# EAGLE schematic smartstand-usb-dac-amplifier-rev-a (EAGLE 7.3.0)

## Sheet 1 of 13
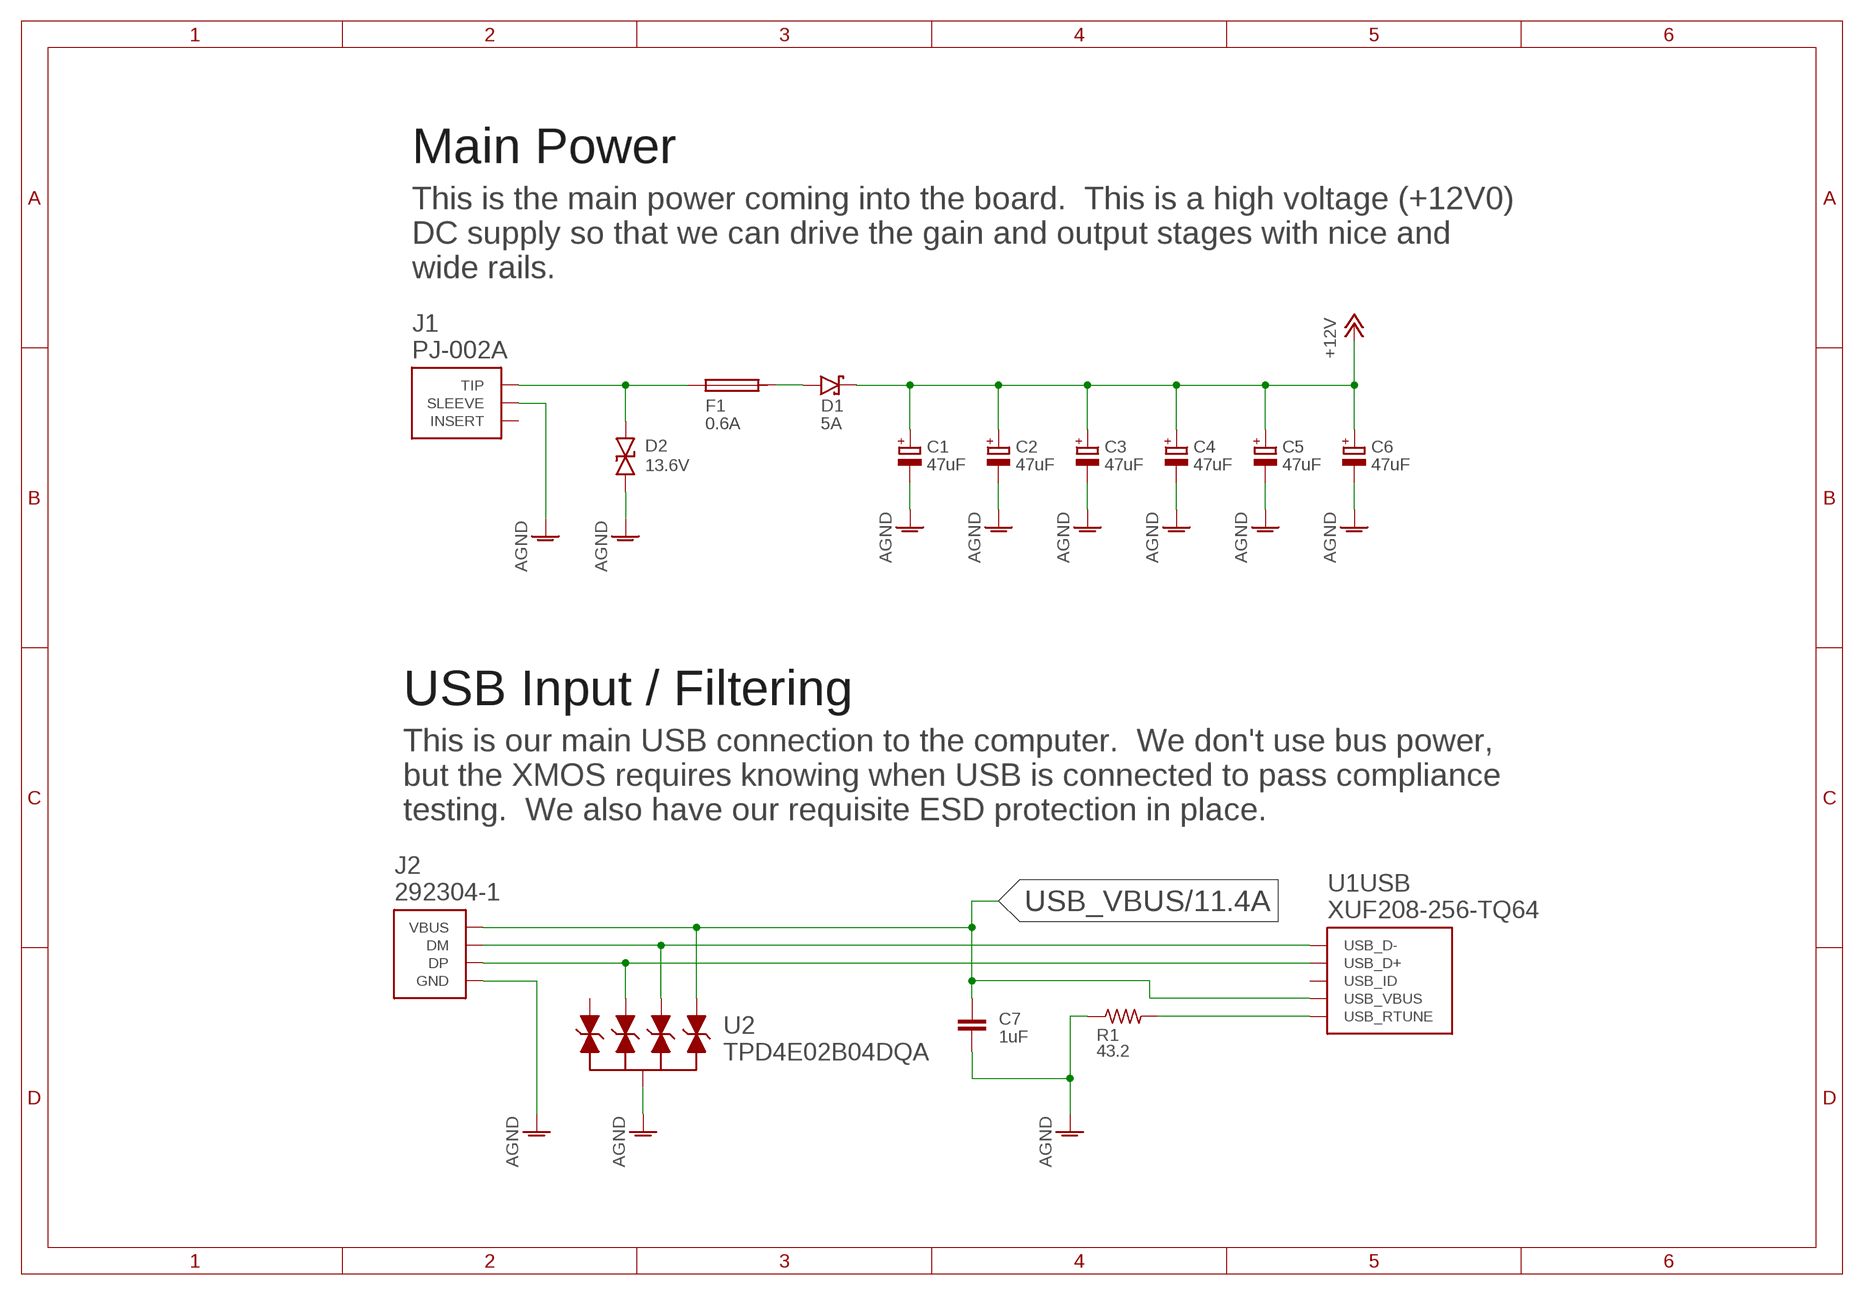
[diagram p0: schematic, sheet 1]
SHEET1 (A4L-NODOC): BOM: EXCLUDE

### Parts
C1  47uF  CAPACITOR-POLARIZEDCHEMICON_F55  [CHEMICON_F55]
C2  47uF  CAPACITOR-POLARIZEDCHEMICON_F55  [CHEMICON_F55]
C3  47uF  CAPACITOR-POLARIZEDCHEMICON_F55  [CHEMICON_F55]
C4  47uF  CAPACITOR-POLARIZEDCHEMICON_F55  [CHEMICON_F55]
C5  47uF  CAPACITOR-POLARIZEDCHEMICON_F55  [CHEMICON_F55]
C6  47uF  CAPACITOR-POLARIZEDCHEMICON_F55  [CHEMICON_F55]
C7  1uF  CAPACITOR-0603  [C0603]
D1  5A  PMEG3050BEP  [SOD128]
D2  13.6V  SUPPRESSOR-DUAL-SMA  [SMA]
F1  0.6A  LITTLEFUSE2920L  [2920L]
J1  PJ-002A  [PJ-002A]
J2  292304-1  [292304]
R1  43.2  RESISTOR-HORIZONTAL-0402  [R0402]
U1  XUF208-256-TQ64  [TQFP-64-EXPOSED-PAD]
U2  TPD4E02B04DQA  [R-PUSON-N10]

### Nets
+12V: C1.+ C2.+ C3.+ C4.+ C5.+ C6.+ D1.C ; also sheet 2,3,7,10,12,13
AGND: C1.- C2.- C3.- C4.- C5.- C6.- C7.2 D2.A J1.2(SLEEVE) J2.P$4(GND) R1.1 U2.P$3(GND) U2.P$8(GND) ; also sheet 2,3,4,5,6,7,8,9,10,11,12,13
N$7: D2.C F1.P$1 J1.1(TIP)
N$8: D1.A F1.P$2
N$37: R1.2 U1.P$24(USB:USB_RTUNE)
USB_D_N [USB]: J2.P$2(DM) U1.P$26(USB:USB_D-) U2.P$4(IO3) U2.P$7(IO3)
USB_D_P [USB]: J2.P$3(DP) U1.P$25(USB:USB_D+) U2.P$2(IO2) U2.P$9(IO2)
USB_VBUS: C7.1 J2.P$1(VBUS) U1.P$23(USB:USB_VBUS) U2.P$5(IO4) U2.P$6(IO4) ; also sheet 11
Unconnected: J1.3(INSERT) U1.P$21(USB:USB_ID) U2.P$1(IO1) U2.P$10(IO1)

### Notes on the sheet
- Main Power
- This is the main power coming into the board.  This is a high voltage (+12V0)
  DC supply so that we can drive the gain and output stages with nice and
  wide rails.
- USB Input / Filtering
- This is our main USB connection to the computer.  We don't use bus power,
  but the XMOS requires knowing when USB is connected to pass compliance
  testing.  We also have our requisite ESD protection in place.

## Sheet 2 of 13
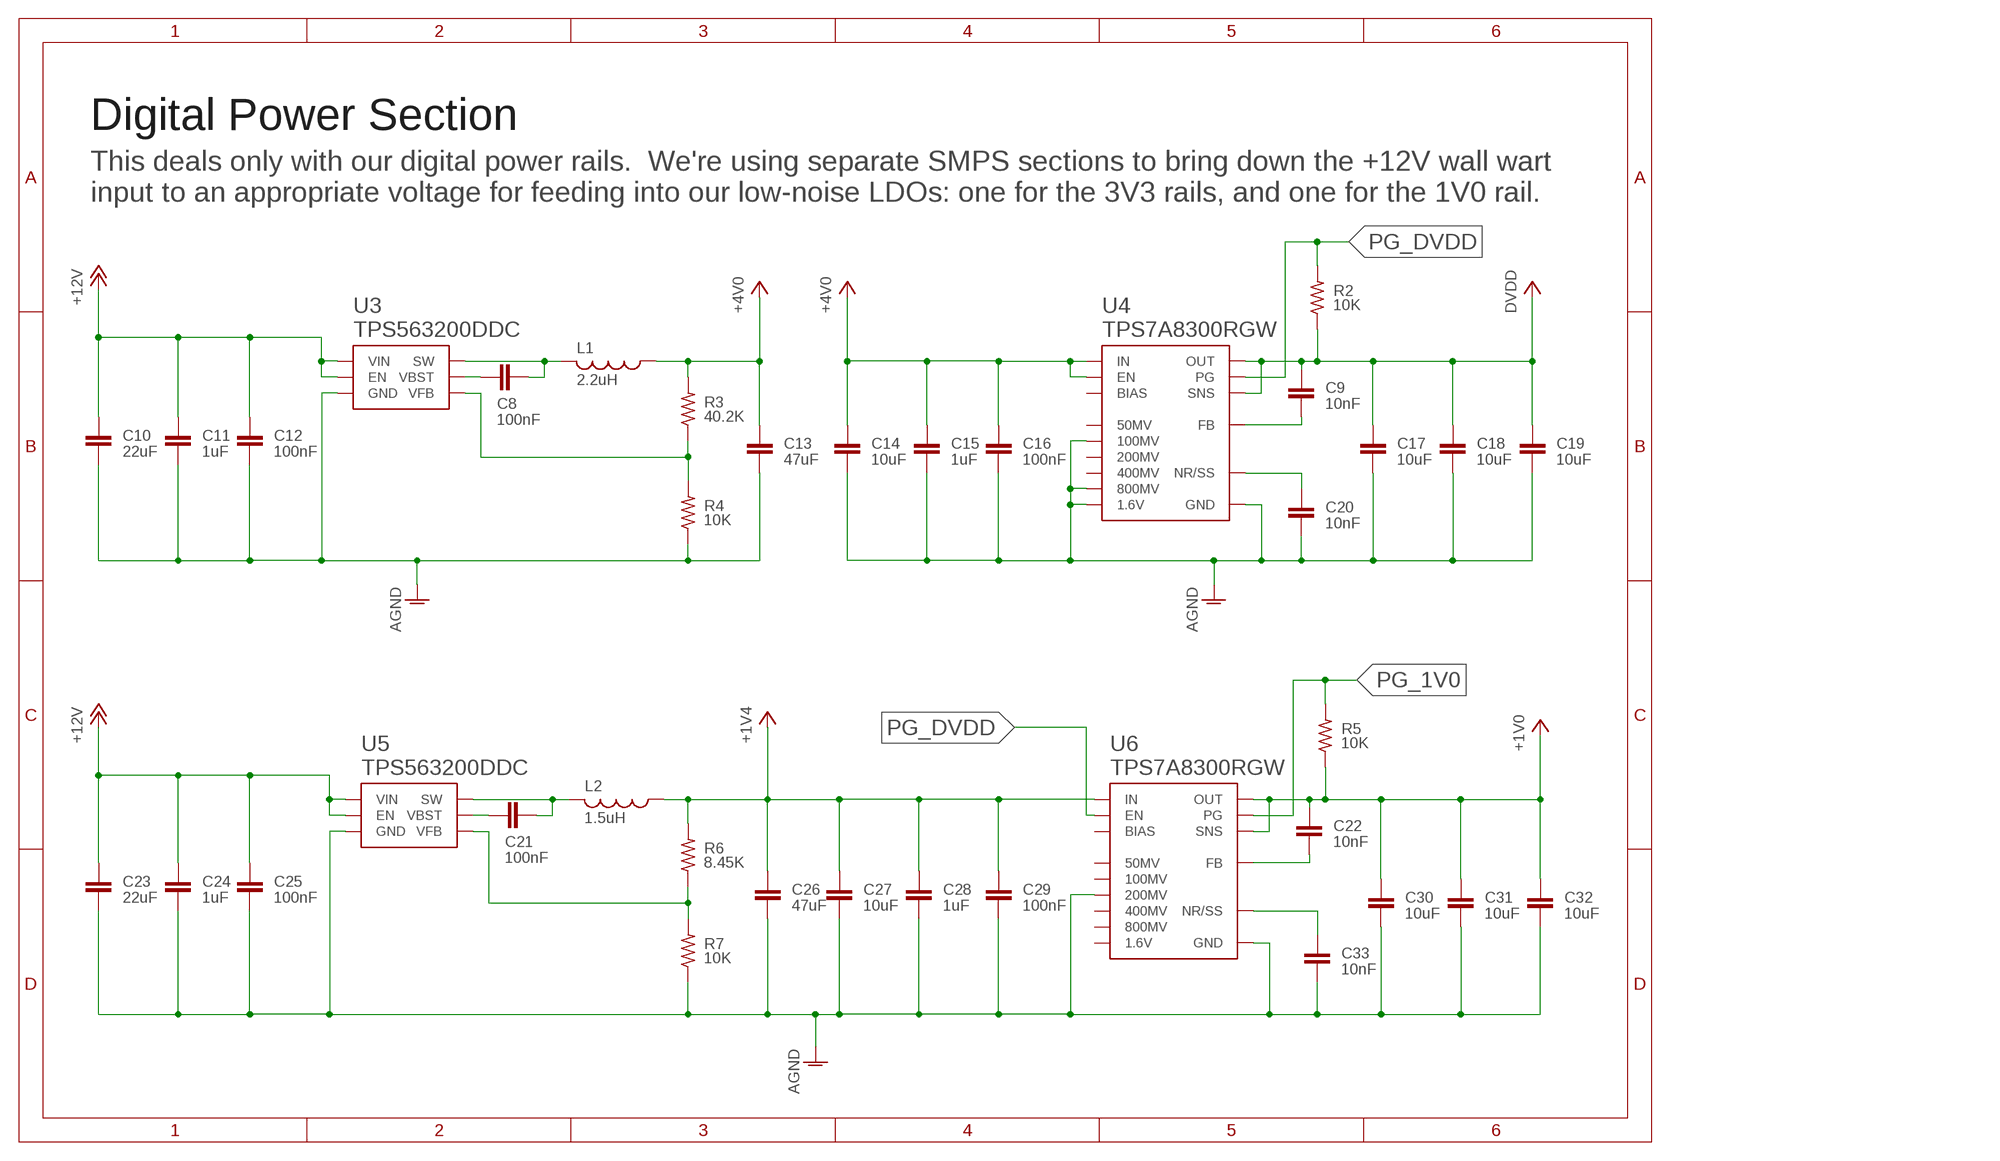
[diagram p1: schematic, sheet 2]
SHEET2 (A4L-NODOC): BOM: EXCLUDE

### Parts
C8  100nF  CAPACITOR-HORIZONTAL-0805  [C0805]
C9  10nF  CAPACITOR-0402  [C0402]
C10  22uF  CAPACITOR-1206  [C1206]
C11  1uF  CAPACITOR-0603  [C0603]
C12  100nF  CAPACITOR-0402  [C0402]
C13  47uF  CAPACITOR-1206  [C1206]
C14  10uF  CAPACITOR-0805  [C0805]
C15  1uF  CAPACITOR-0603  [C0603]
C16  100nF  CAPACITOR-0402  [C0402]
C17  10uF  CAPACITOR-0805  [C0805]
C18  10uF  CAPACITOR-0805  [C0805]
C19  10uF  CAPACITOR-0805  [C0805]
C20  10nF  CAPACITOR-0402  [C0402]
C21  100nF  CAPACITOR-HORIZONTAL-0805  [C0805]
C22  10nF  CAPACITOR-0402  [C0402]
C23  22uF  CAPACITOR-1206  [C1206]
C24  1uF  CAPACITOR-0603  [C0603]
C25  100nF  CAPACITOR-0402  [C0402]
C26  47uF  CAPACITOR-1206  [C1206]
C27  10uF  CAPACITOR-0805  [C0805]
C28  1uF  CAPACITOR-0603  [C0603]
C29  100nF  CAPACITOR-0402  [C0402]
C30  10uF  CAPACITOR-0805  [C0805]
C31  10uF  CAPACITOR-0805  [C0805]
C32  10uF  CAPACITOR-0805  [C0805]
C33  10nF  CAPACITOR-0402  [C0402]
L1  2.2uH  INDUCTOR-HORIZONTALVLP8040  [TDK-VLP8040]
L2  1.5uH  INDUCTOR-HORIZONTALVLP8040  [TDK-VLP8040]
R2  10K  RESISTOR-0402  [R0402]
R3  40.2K  RESISTOR-0402  [R0402]
R4  10K  RESISTOR-0402  [R0402]
R5  10K  RESISTOR-0402  [R0402]
R6  8.45K  RESISTOR-0402  [R0402]
R7  10K  RESISTOR-0402  [R0402]
U3  TPS563200DDC  [R-PDSO-G6-DBV]
U4  TPS7A8300RGW  [S-PVQFN-N20]
U5  TPS563200DDC  [R-PDSO-G6-DBV]
U6  TPS7A8300RGW  [S-PVQFN-N20]

### Nets
+1V0: C22.1 C30.1 C31.1 C32.1 R5.1 U6.P$1(OUT) U6.P$2(SNS) U6.P$19(OUT) U6.P$20(OUT) ; also sheet 4,5,12
+1V4: C26.1 C27.1 C28.1 C29.1 L2.P$1 R6.2 U6.P$15(IN) U6.P$16(IN) U6.P$17(IN) ; also sheet 12
+4V0: C13.1 C14.1 C15.1 C16.1 L1.P$1 R3.2 U4.P$14(EN) U4.P$15(IN) U4.P$16(IN) U4.P$17(IN) ; also sheet 3,4,12
+12V: C10.1 C11.1 C12.1 C23.1 C24.1 C25.1 U3.3(VIN) U3.5(EN) U5.3(VIN) U5.5(EN) ; also sheet 1,3,7,10,12,13
AGND: C10.2 C11.2 C12.2 C13.2 C14.2 C15.2 C16.2 C17.2 C18.2 C19.2 C20.2 C23.2 C24.2 C25.2 C26.2 C27.2 C28.2 C29.2 C30.2 C31.2 C32.2 C33.2 R4.1 R7.1 U3.1(GND) U4.P$6(100MV) U4.P$8(GND) U4.P$10(800MV) U4.P$11(1.6V) U4.P$18(GND) U4.P$21(GND) U4.P$22(GND) U4.P$23(GND) U4.P$24(GND) U4.P$25(GND) U4.P$26(GND) U4.P$27(GND) U4.P$28(GND) U4.P$29(GND) U4.P$EP(GND) U5.1(GND) U6.P$7(200MV) U6.P$8(GND) U6.P$18(GND) U6.P$21(GND) U6.P$22(GND) U6.P$23(GND) U6.P$24(GND) U6.P$25(GND) U6.P$26(GND) U6.P$27(GND) U6.P$28(GND) U6.P$29(GND) U6.P$EP(GND) ; also sheet 1,3,4,5,6,7,8,9,10,11,12,13
DVDD: C9.1 C17.1 C18.1 C19.1 R2.1 U4.P$1(OUT) U4.P$2(SNS) U4.P$19(OUT) U4.P$20(OUT) ; also sheet 4,5,6,9,10,11,12
N$9: C20.1 U4.P$13(NR/SS)
N$11: C9.2 U4.P$3(FB)
N$50: C8.2 L1.P$2 U3.2(SW)
N$52: C8.1 U3.6(VBST)
N$53: R3.1 R4.2 U3.4(VFB)
N$54: C21.2 L2.P$2 U5.2(SW)
N$55: C21.1 U5.6(VBST)
N$56: R6.1 R7.2 U5.4(VFB)
N$57: C33.1 U6.P$13(NR/SS)
N$58: C22.2 U6.P$3(FB)
PG_1V0: R5.2 U6.P$4(PG)
PG_DVDD: R2.2 U4.P$4(PG) U6.P$14(EN)
Unconnected: U4.P$5(50MV) U4.P$7(200MV) U4.P$9(400MV) U4.P$12(BIAS) U6.P$5(50MV) U6.P$6(100MV) U6.P$9(400MV) U6.P$10(800MV) U6.P$11(1.6V) U6.P$12(BIAS)

### Notes on the sheet
- Digital Power Section
- This deals only with our digital power rails.  We're using separate SMPS sections to bring down the +12V wall wart
  input to an appropriate voltage for feeding into our low-noise LDOs: one for the 3V3 rails, and one for the 1V0 rail.

## Sheet 3 of 13
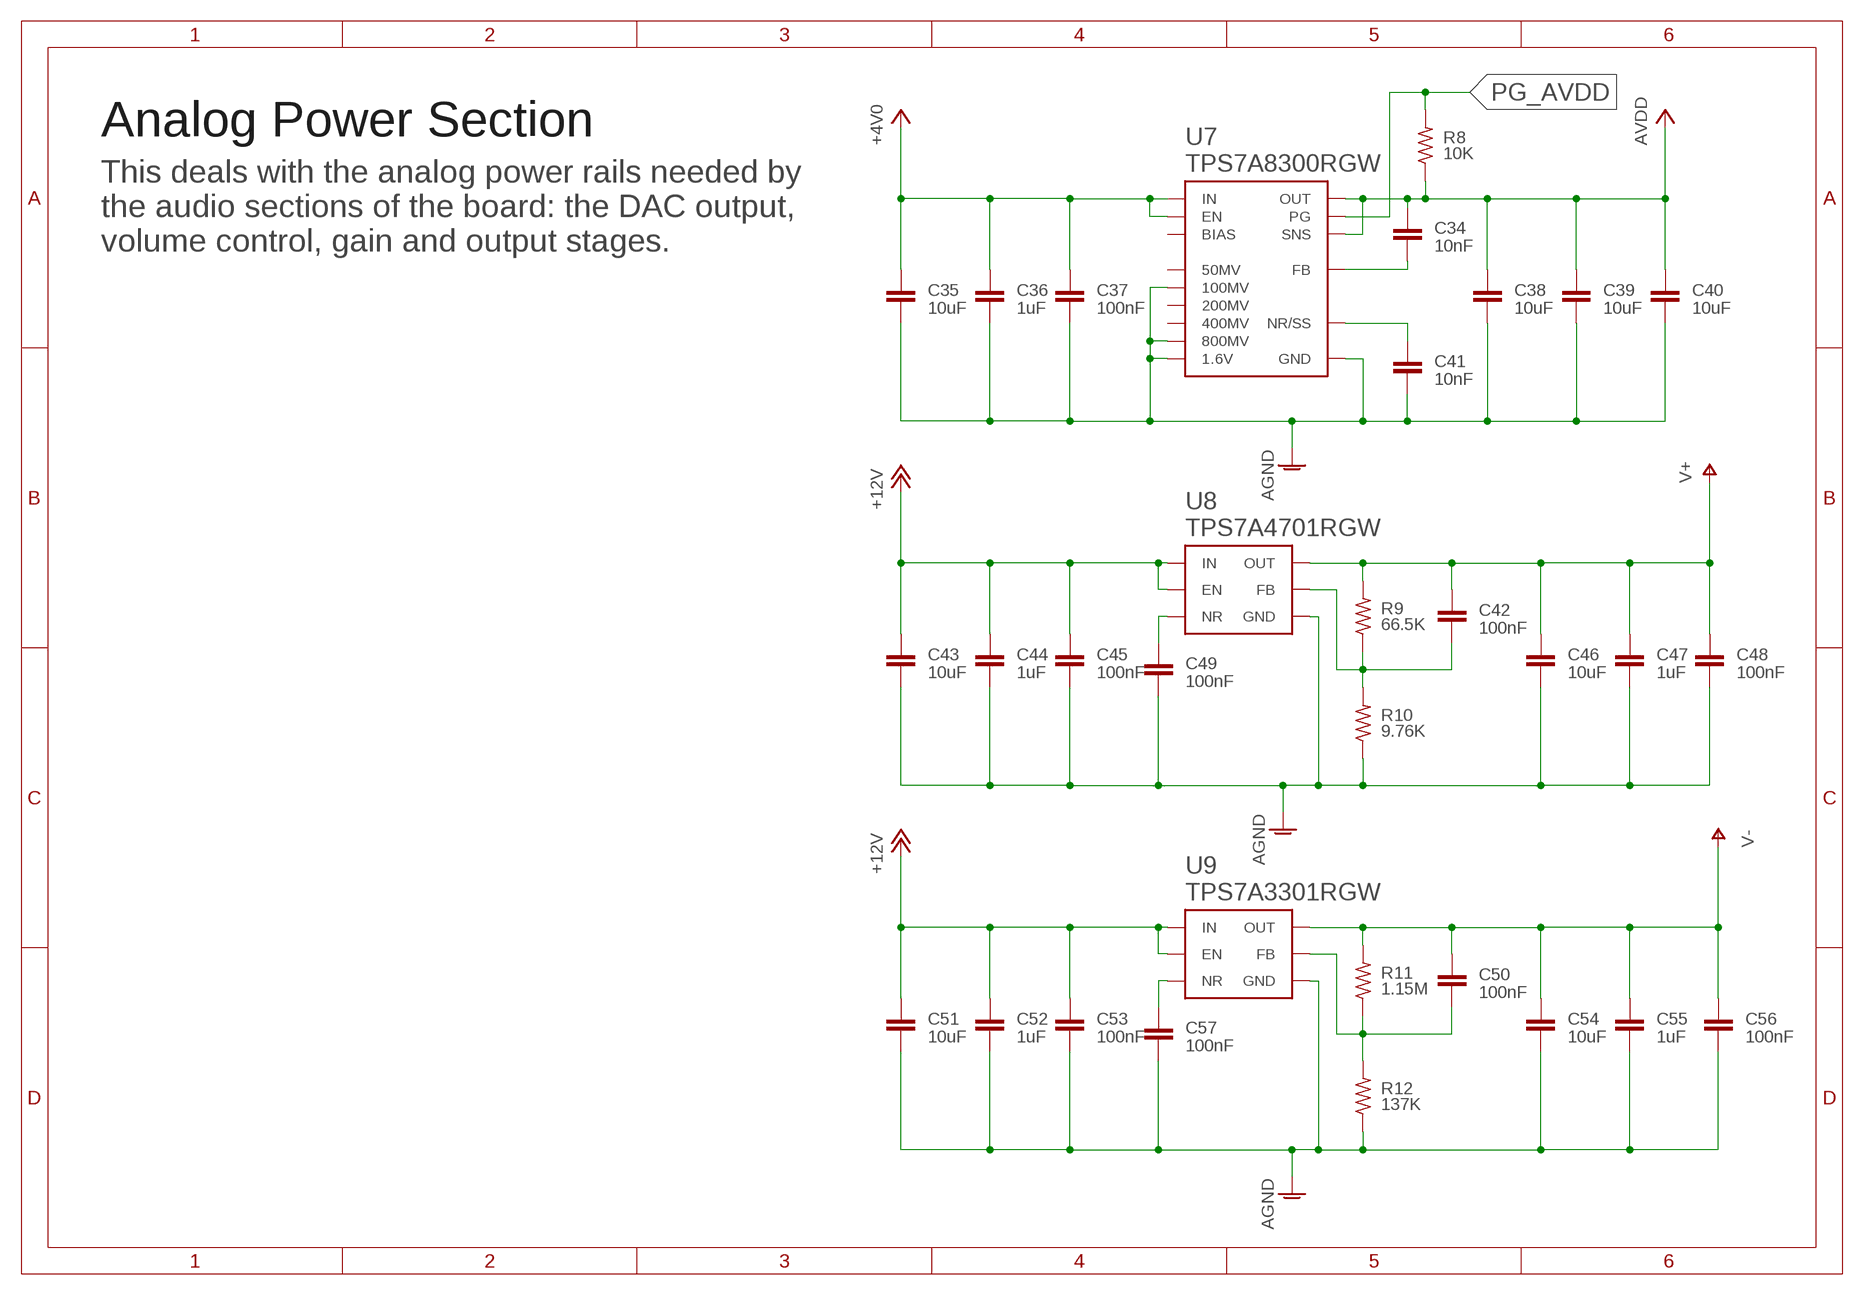
[diagram p2: schematic, sheet 3]
SHEET3 (A4L-NODOC): BOM: EXCLUDE

### Parts
C34  10nF  CAPACITOR-0402  [C0402]
C35  10uF  CAPACITOR-0805  [C0805]
C36  1uF  CAPACITOR-0603  [C0603]
C37  100nF  CAPACITOR-0402  [C0402]
C38  10uF  CAPACITOR-0805  [C0805]
C39  10uF  CAPACITOR-0805  [C0805]
C40  10uF  CAPACITOR-0805  [C0805]
C41  10nF  CAPACITOR-0402  [C0402]
C42  100nF  CAPACITOR-0402  [C0402]
C43  10uF  CAPACITOR-0805  [C0805]
C44  1uF  CAPACITOR-0603  [C0603]
C45  100nF  CAPACITOR-0402  [C0402]
C46  10uF  CAPACITOR-0805  [C0805]
C47  1uF  CAPACITOR-0603  [C0603]
C48  100nF  CAPACITOR-0402  [C0402]
C49  100nF  CAPACITOR-0402  [C0402]
C50  100nF  CAPACITOR-0402  [C0402]
C51  10uF  CAPACITOR-0805  [C0805]
C52  1uF  CAPACITOR-0603  [C0603]
C53  100nF  CAPACITOR-0402  [C0402]
C54  10uF  CAPACITOR-0805  [C0805]
C55  1uF  CAPACITOR-0603  [C0603]
C56  100nF  CAPACITOR-0402  [C0402]
C57  100nF  CAPACITOR-0402  [C0402]
R8  10K  RESISTOR-0402  [R0402]
R9  66.5K  RESISTOR-0402  [R0402]
R10  9.76K  RESISTOR-0402  [R0402]
R11  1.15M  RESISTOR-0402  [R0402]
R12  137K  RESISTOR-0402  [R0402]
U7  TPS7A8300RGW  [S-PVQFN-N20]
U8  TPS7A4701RGW  [S-PVQFN-N20]
U9  TPS7A3301RGW  [S-PVQFN-N20]

### Nets
+4V0: C35.1 C36.1 C37.1 U7.P$14(EN) U7.P$15(IN) U7.P$16(IN) U7.P$17(IN) ; also sheet 2,4,12
+12V: C43.1 C44.1 C45.1 C51.1 C52.1 C53.1 U8.P$13(EN) U8.P$15(IN) U8.P$16(IN) U9.P$13(EN) U9.P$15(IN) U9.P$16(IN) ; also sheet 1,2,7,10,12,13
AGND: C35.2 C36.2 C37.2 C38.2 C39.2 C40.2 C41.2 C43.2 C44.2 C45.2 C46.2 C47.2 C48.2 C49.2 C51.2 C52.2 C53.2 C54.2 C55.2 C56.2 C57.2 R10.1 R12.1 U7.P$6(100MV) U7.P$8(GND) U7.P$10(800MV) U7.P$11(1.6V) U7.P$18(GND) U7.P$21(GND) U7.P$22(GND) U7.P$23(GND) U7.P$24(GND) U7.P$25(GND) U7.P$26(GND) U7.P$27(GND) U7.P$28(GND) U7.P$29(GND) U7.P$EP(GND) U8.P$7(GND) U8.P$17(GND) U8.P$18(GND) U8.P$19(GND) U8.P$21(GND) U8.P$22(GND) U8.P$23(GND) U8.P$24(GND) U8.P$25(GND) U8.P$26(GND) U8.P$27(GND) U8.P$28(GND) U8.P$29(GND) U8.P$EP(GND) U9.P$7(GND) U9.P$17(GND) U9.P$18(GND) U9.P$19(GND) U9.P$21(GND) U9.P$22(GND) U9.P$23(GND) U9.P$24(GND) U9.P$25(GND) U9.P$26(GND) U9.P$27(GND) U9.P$28(GND) U9.P$29(GND) U9.P$EP(GND) ; also sheet 1,2,4,5,6,7,8,9,10,11,12,13
AVDD: C34.1 C38.1 C39.1 C40.1 R8.1 U7.P$1(OUT) U7.P$2(SNS) U7.P$19(OUT) U7.P$20(OUT) ; also sheet 6,11,12
N$12: C57.1 U9.P$14(NR)
N$13: C49.1 U8.P$14(NR)
N$14: C42.2 R9.1 R10.2 U8.P$3(FB)
N$16: C50.2 R11.1 R12.2 U9.P$3(FB)
N$60: C41.1 U7.P$13(NR/SS)
N$61: C34.2 U7.P$3(FB)
PG_AVDD: R8.2 U7.P$4(PG)
V+: C42.1 C46.1 C47.1 C48.1 R9.2 U8.P$1(OUT) U8.P$20(OUT) ; also sheet 7,8,12
V-: C50.1 C54.1 C55.1 C56.1 R11.2 U9.P$1(OUT) U9.P$20(OUT) ; also sheet 7,8,12
Unconnected: U7.P$5(50MV) U7.P$7(200MV) U7.P$9(400MV) U7.P$12(BIAS)

### Notes on the sheet
- Analog Power Section
- This deals with the analog power rails needed by
  the audio sections of the board: the DAC output,
  volume control, gain and output stages.

## Sheet 4 of 13
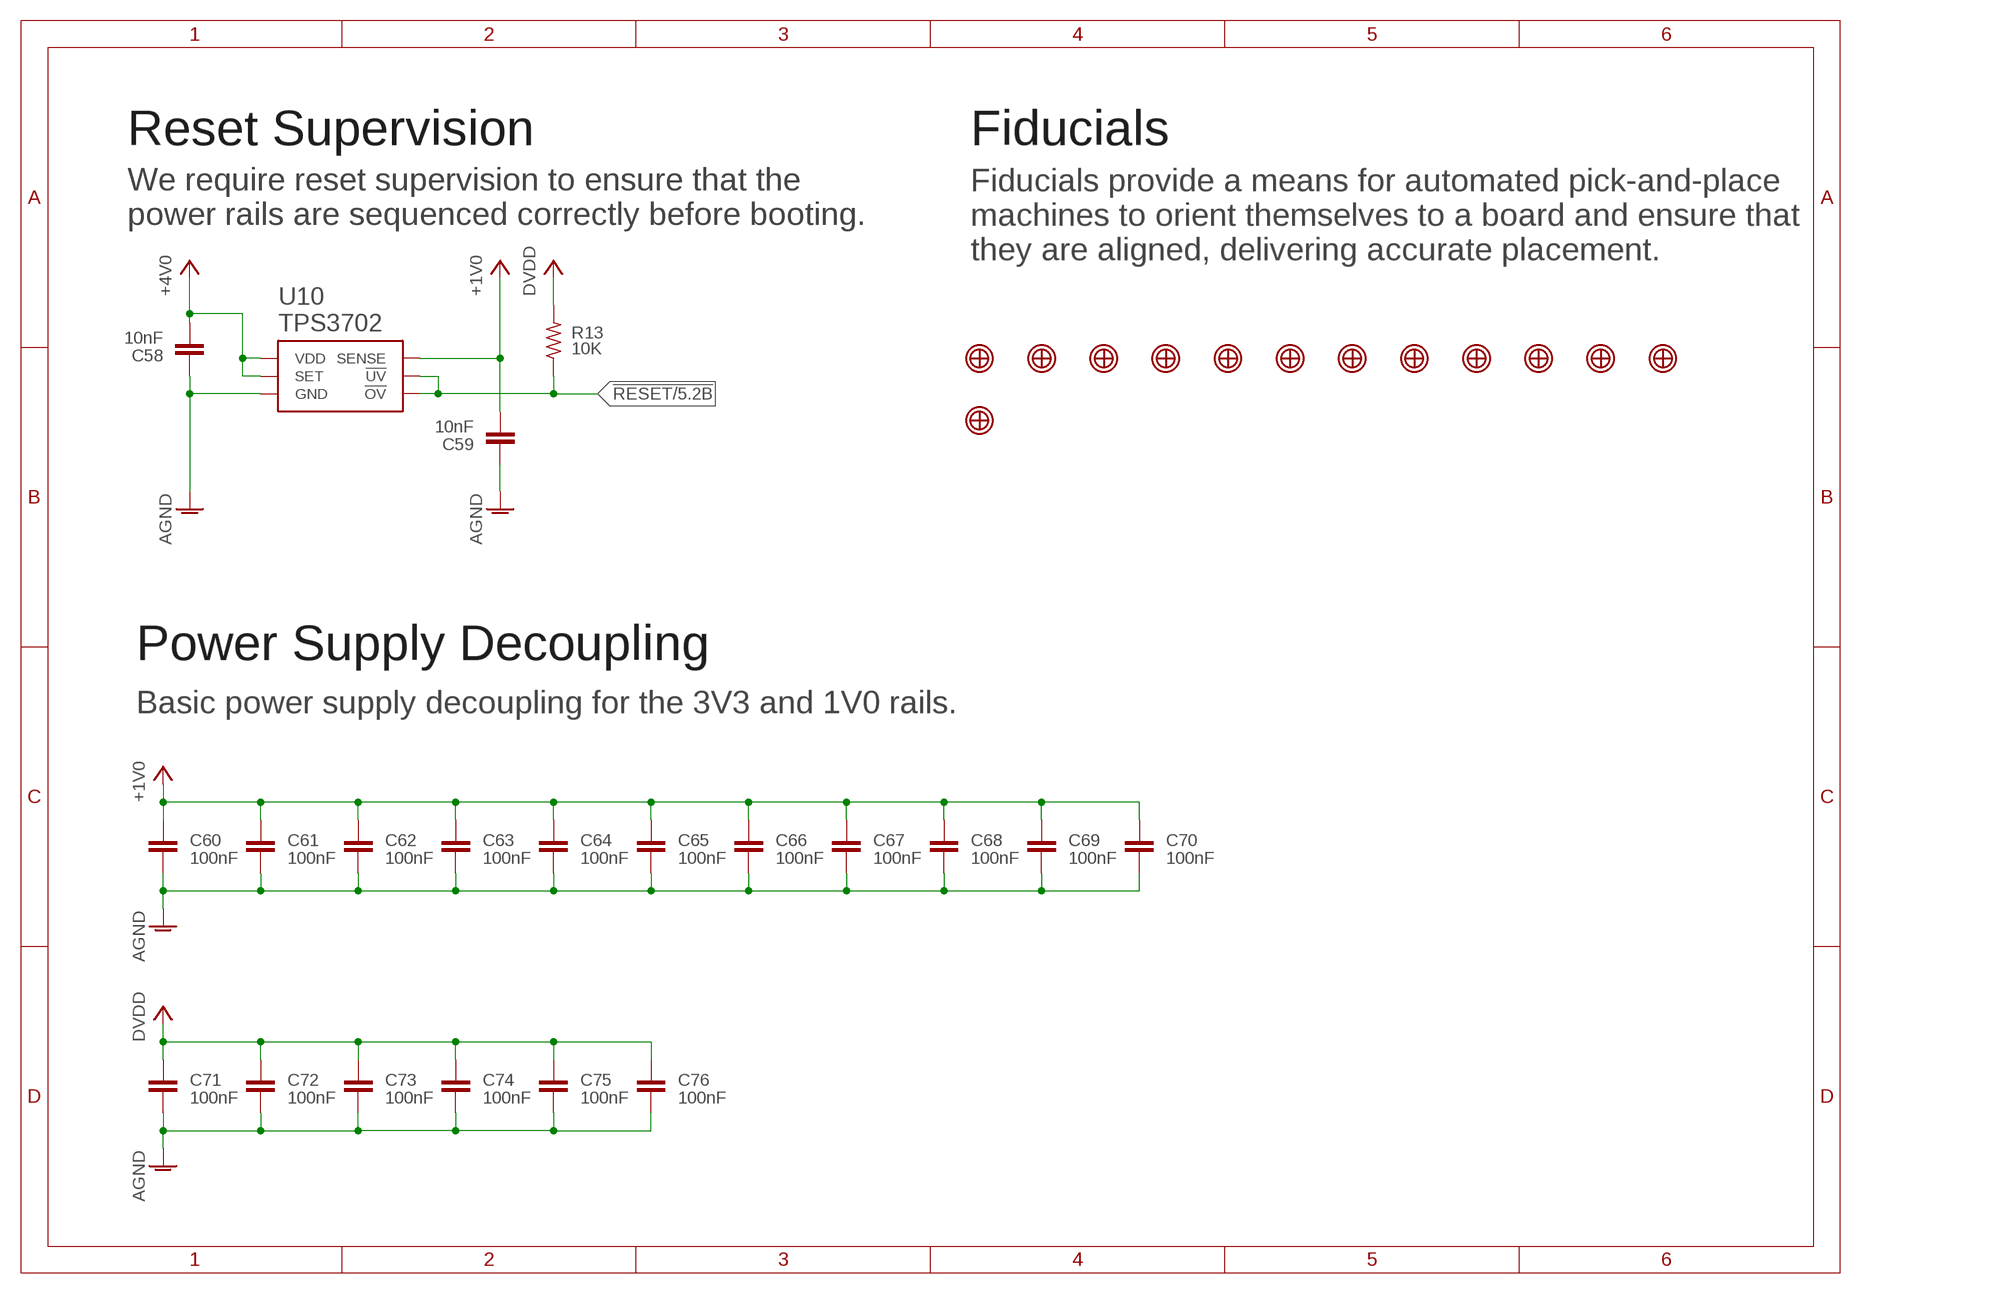
[diagram p3: schematic, sheet 4]
SHEET4 (A4L-NODOC): BOM: EXCLUDE

### Parts
C58  10nF  CAPACITOR-0402  [C0402]
C59  10nF  CAPACITOR-0402  [C0402]
C60  100nF  CAPACITOR-0402  [C0402]
C61  100nF  CAPACITOR-0402  [C0402]
C62  100nF  CAPACITOR-0402  [C0402]
C63  100nF  CAPACITOR-0402  [C0402]
C64  100nF  CAPACITOR-0402  [C0402]
C65  100nF  CAPACITOR-0402  [C0402]
C66  100nF  CAPACITOR-0402  [C0402]
C67  100nF  CAPACITOR-0402  [C0402]
C68  100nF  CAPACITOR-0402  [C0402]
C69  100nF  CAPACITOR-0402  [C0402]
C70  100nF  CAPACITOR-0402  [C0402]
C71  100nF  CAPACITOR-0402  [C0402]
C72  100nF  CAPACITOR-0402  [C0402]
C73  100nF  CAPACITOR-0402  [C0402]
C74  100nF  CAPACITOR-0402  [C0402]
C75  100nF  CAPACITOR-0402  [C0402]
C76  100nF  CAPACITOR-0402  [C0402]
R13  10K  RESISTOR-0402  [R0402]
U10  TPS3702  TPS3702CX10DDC  [R-PDSO-G6-DBV]
U$1  FIDUCIAL-1MM  [FIDUCIAL_1MM]
U$2  FIDUCIAL-1MM  [FIDUCIAL_1MM]
U$3  FIDUCIAL-1MM  [FIDUCIAL_1MM]
U$4  FIDUCIAL-1MM  [FIDUCIAL_1MM]
U$5  FIDUCIAL-1MM  [FIDUCIAL_1MM]
U$6  FIDUCIAL-1MM  [FIDUCIAL_1MM]
U$7  FIDUCIAL-1MM  [FIDUCIAL_1MM]
U$8  FIDUCIAL-1MM  [FIDUCIAL_1MM]
U$9  FIDUCIAL-1MM  [FIDUCIAL_1MM]
U$10  FIDUCIAL-1MM  [FIDUCIAL_1MM]
U$11  FIDUCIAL-1MM  [FIDUCIAL_1MM]
U$12  FIDUCIAL-1MM  [FIDUCIAL_1MM]
U$13  FIDUCIAL-1MM  [FIDUCIAL_1MM]

### Nets
!RESET: R13.1 U10.1(!UV) U10.6(!OV) ; also sheet 5,12
+1V0: C59.2 C60.1 C61.1 C62.1 C63.1 C64.1 C65.1 C66.1 C67.1 C68.1 C69.1 C70.1 U10.3(SENSE) ; also sheet 2,5,12
+4V0: C58.2 U10.4(SET) U10.5(VDD) ; also sheet 2,3,12
AGND: C58.1 C59.1 C60.2 C61.2 C62.2 C63.2 C64.2 C65.2 C66.2 C67.2 C68.2 C69.2 C70.2 C71.2 C72.2 C73.2 C74.2 C75.2 C76.2 U10.2(GND) ; also sheet 1,2,3,5,6,7,8,9,10,11,12,13
DVDD: C71.1 C72.1 C73.1 C74.1 C75.1 C76.1 R13.2 ; also sheet 2,5,6,9,10,11,12

### Notes on the sheet
- Reset Supervision | Fiducials
- We require reset supervision to ensure that the
  power rails are sequenced correctly before booting.
- Fiducials provide a means for automated pick-and-place
  machines to orient themselves to a board and ensure that
  they are aligned, delivering accurate placement.
- Power Supply Decoupling
- Basic power supply decoupling for the 3V3 and 1V0 rails.

## Sheet 5 of 13
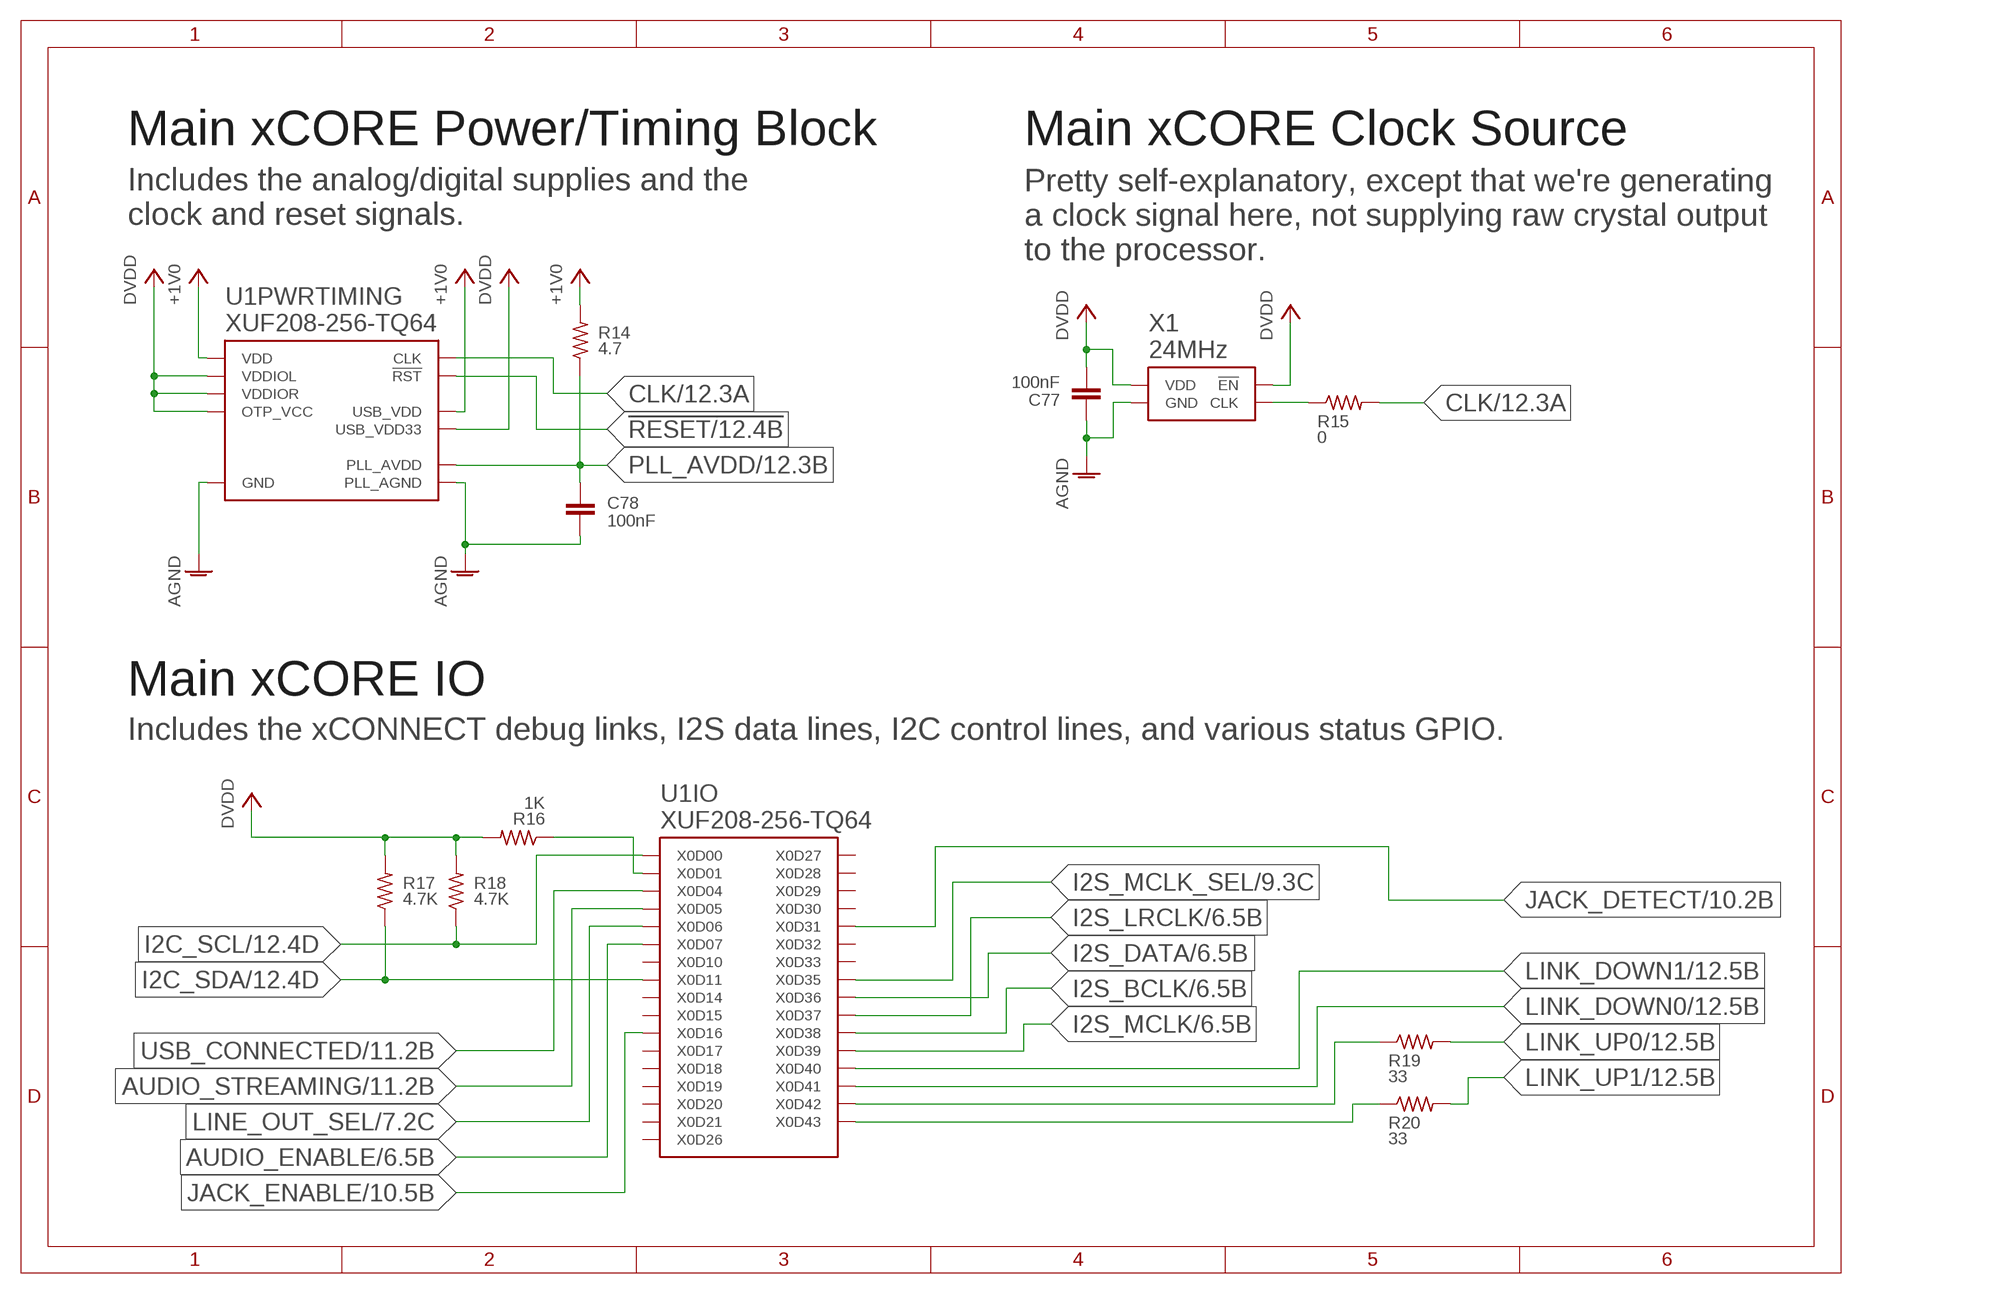
[diagram p4: schematic, sheet 5]
SHEET5 (A4L-NODOC): BOM: EXCLUDE

### Parts
C77  100nF  CAPACITOR-0402  [C0402]
C78  100nF  CAPACITOR-0402  [C0402]
R14  4.7  RESISTOR-0402  [R0402]
R15  0  RESISTOR-HORIZONTAL-0402  [R0402]
R16  1K  RESISTOR-HORIZONTAL-0402  [R0402]
R17  4.7K  RESISTOR-0402  [R0402]
R18  4.7K  RESISTOR-0402  [R0402]
R19  33  RESISTOR-HORIZONTAL-0402  [R0402]
R20  33  RESISTOR-HORIZONTAL-0402  [R0402]
X1  24MHz  KC2520C  [KC2520C]

### Nets
!RESET: U1.P$57(PWRTIMING:!RST) ; also sheet 4,12
+1V0: R14.2 U1.P$9(PWRTIMING:VDD) U1.P$10(PWRTIMING:VDD) U1.P$20(PWRTIMING:VDD) U1.P$27(PWRTIMING:USB_VDD) U1.P$31(PWRTIMING:VDD) U1.P$39(PWRTIMING:VDD) U1.P$40(PWRTIMING:VDD) U1.P$41(PWRTIMING:VDD) U1.P$52(PWRTIMING:VDD) U1.P$56(PWRTIMING:VDD) U1.P$59(PWRTIMING:VDD) ; also sheet 2,4,12
AGND: C77.1 C78.2 U1.P$54(PWRTIMING:PLL_AGND) U1.P$65(PWRTIMING:GND) U1.P$66(PWRTIMING:GND) U1.P$67(PWRTIMING:GND) U1.P$68(PWRTIMING:GND) U1.P$69(PWRTIMING:GND) U1.P$70(PWRTIMING:GND) U1.P$71(PWRTIMING:GND) U1.P$72(PWRTIMING:GND) U1.P$73(PWRTIMING:GND) U1.P$74(PWRTIMING:GND) X1.P$2(GND) ; also sheet 1,2,3,4,6,7,8,9,10,11,12,13
AUDIO_ENABLE: U1.P$19(IO:X0D07) ; also sheet 6
AUDIO_STREAMING: U1.P$17(IO:X0D05) ; also sheet 11
CLK: R15.2 U1.P$58(PWRTIMING:CLK) ; also sheet 12
DVDD: C77.2 R16.2 R17.2 R18.2 U1.P$3(PWRTIMING:VDDIOL) U1.P$13(PWRTIMING:VDDIOL) U1.P$22(PWRTIMING:USB_VDD33) U1.P$34(PWRTIMING:VDDIOR) U1.P$44(PWRTIMING:VDDIOR) U1.P$55(PWRTIMING:OTP_VCC) X1.P$1(!EN) X1.P$4(VDD) ; also sheet 2,4,6,9,10,11,12
I2C_SCL: R18.1 U1.P$14(IO:X0D00) ; also sheet 12
I2C_SDA: R17.1 U1.P$16(IO:X0D11) ; also sheet 12
I2S_BCLK: U1.P$2(IO:X0D38) ; also sheet 6
I2S_DATA: U1.P$1(IO:X0D36) ; also sheet 6
I2S_LRCLK: U1.P$64(IO:X0D37) ; also sheet 6
I2S_MCLK: U1.P$4(IO:X0D39) ; also sheet 6,9
I2S_MCLK_SEL: U1.P$42(IO:X0D35) ; also sheet 9
JACK_DETECT: U1.P$51(IO:X0D31) ; also sheet 10
JACK_ENABLE: U1.P$35(IO:X0D16) ; also sheet 10
LINE_OUT_SEL: U1.P$18(IO:X0D06) ; also sheet 7,11
LINK_DOWN0: U1.P$6(IO:X0D41) ; also sheet 12
LINK_DOWN1: U1.P$5(IO:X0D40) ; also sheet 12
LINK_UP0: R19.2 ; also sheet 12
LINK_UP1: R20.2 ; also sheet 12
N$33: R15.1 X1.P$3(CLK)
N$34: R19.1 U1.P$7(IO:X0D42)
N$35: R20.1 U1.P$8(IO:X0D43)
N$36: R16.1 U1.P$11(IO:X0D01)
PLL_AVDD: C78.1 R14.1 U1.P$53(PWRTIMING:PLL_AVDD) ; also sheet 12
USB_CONNECTED: U1.P$15(IO:X0D04) ; also sheet 11
Unconnected: U1.P$12(IO:X0D10) U1.P$28(IO:X0D14) U1.P$29(IO:X0D15) U1.P$30(IO:X0D20) U1.P$32(IO:X0D21) U1.P$36(IO:X0D17) U1.P$37(IO:X0D18) U1.P$38(IO:X0D19) U1.P$43(IO:X0D26) U1.P$45(IO:X0D27) U1.P$46(IO:X0D32) U1.P$47(IO:X0D28) U1.P$48(IO:X0D33) U1.P$49(IO:X0D29) U1.P$50(IO:X0D30)

### Notes on the sheet
- Main xCORE Power/Timing Block | Main xCORE Clock Source
- Includes the analog/digital supplies and the
  clock and reset signals.
- Pretty self-explanatory, except that we're generating
  a clock signal here, not supplying raw crystal output
  to the processor.
- Main xCORE IO
- Includes the xCONNECT debug links, I2S data lines, I2C control lines, and various status GPIO.

## Sheet 6 of 13
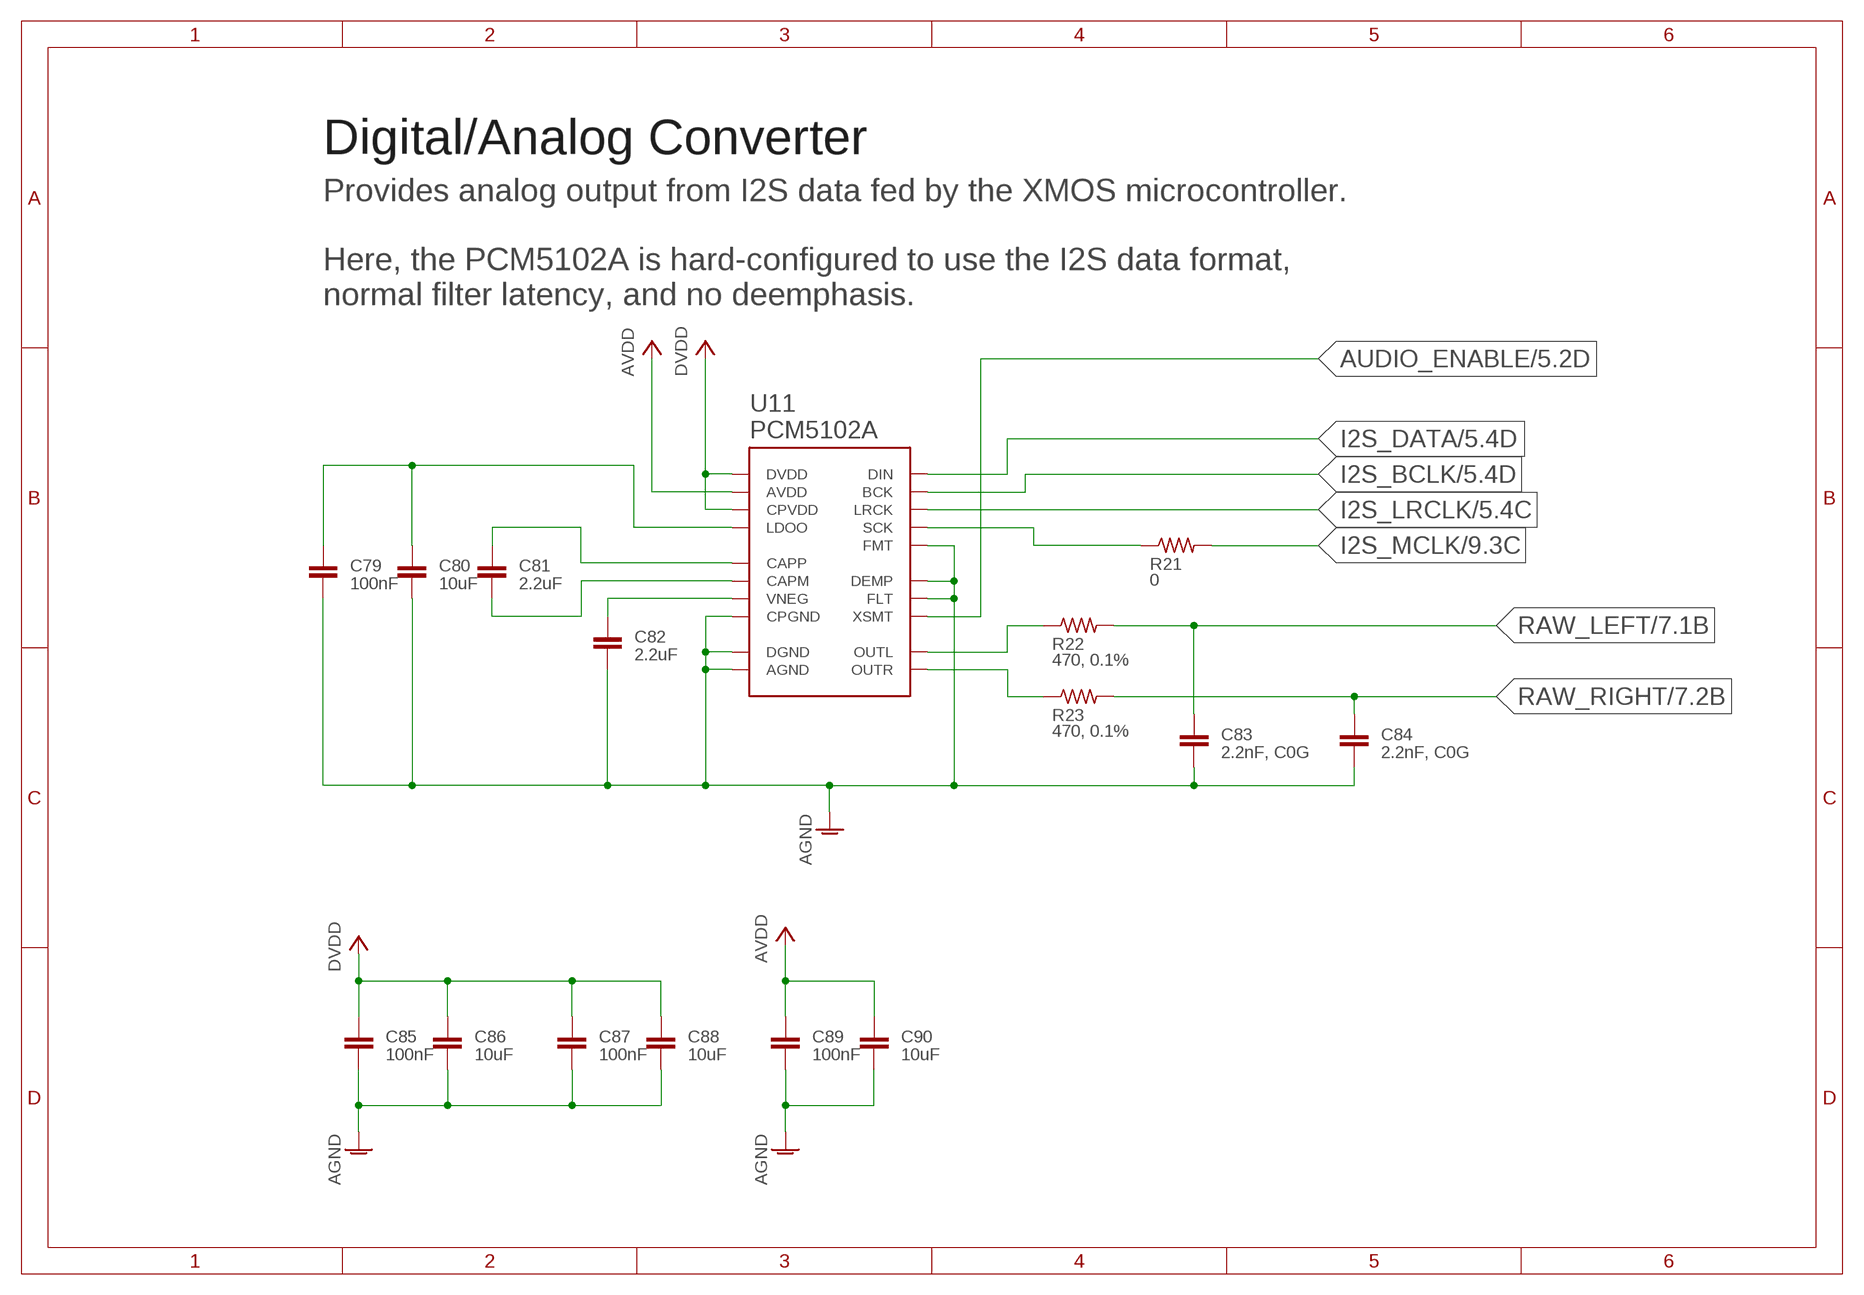
[diagram p5: schematic, sheet 6]
SHEET6 (A4L-NODOC): BOM: EXCLUDE

### Parts
C79  100nF  CAPACITOR-0402  [C0402]
C80  10uF  CAPACITOR-0805  [C0805]
C81  2.2uF  CAPACITOR-0603  [C0603]
C82  2.2uF  CAPACITOR-0603  [C0603]
C83  2.2nF, C0G  CAPACITOR-0402  [C0402]
C84  2.2nF, C0G  CAPACITOR-0402  [C0402]
C85  100nF  CAPACITOR-0402  [C0402]
C86  10uF  CAPACITOR-0805  [C0805]
C87  100nF  CAPACITOR-0402  [C0402]
C88  10uF  CAPACITOR-0805  [C0805]
C89  100nF  CAPACITOR-0402  [C0402]
C90  10uF  CAPACITOR-0805  [C0805]
R21  0  RESISTOR-HORIZONTAL-0402  [R0402]
R22  470, 0.1%  RESISTOR-HORIZONTAL-0402  [R0402]
R23  470, 0.1%  RESISTOR-HORIZONTAL-0402  [R0402]
U11  PCM5102A  [R-PDSO-G20]

### Nets
AGND: C79.2 C80.2 C82.2 C83.2 C84.2 C85.2 C86.2 C87.2 C88.2 C89.2 C90.2 U11.P$3(CPGND) U11.P$9(AGND) U11.P$10(DEMP) U11.P$11(FLT) U11.P$16(FMT) U11.P$19(DGND) ; also sheet 1,2,3,4,5,7,8,9,10,11,12,13
AUDIO_ENABLE: U11.P$17(XSMT) ; also sheet 5
AVDD: C89.1 C90.1 U11.P$8(AVDD) ; also sheet 3,11,12
DVDD: C85.1 C86.1 C87.1 C88.1 U11.P$1(CPVDD) U11.P$20(DVDD) ; also sheet 2,4,5,9,10,11,12
I2S_BCLK: U11.P$13(BCK) ; also sheet 5
I2S_DATA: U11.P$14(DIN) ; also sheet 5
I2S_LRCLK: U11.P$15(LRCK) ; also sheet 5
I2S_MCLK: R21.2 ; also sheet 5,9
N$1: C81.1 U11.P$2(CAPP)
N$2: C81.2 U11.P$4(CAPM)
N$3: C82.1 U11.P$5(VNEG)
N$4: C79.1 C80.1 U11.P$18(LDOO)
N$5: R22.1 U11.P$6(OUTL)
N$6: R23.1 U11.P$7(OUTR)
N$63: R21.1 U11.P$12(SCK)
RAW_LEFT: C83.1 R22.2 ; also sheet 7
RAW_RIGHT: C84.1 R23.2 ; also sheet 7

### Notes on the sheet
- Digital/Analog Converter
- Provides analog output from I2S data fed by the XMOS microcontroller.
  
  Here, the PCM5102A is hard-configured to use the I2S data format, 
  normal filter latency, and no deemphasis.

## Sheet 7 of 13
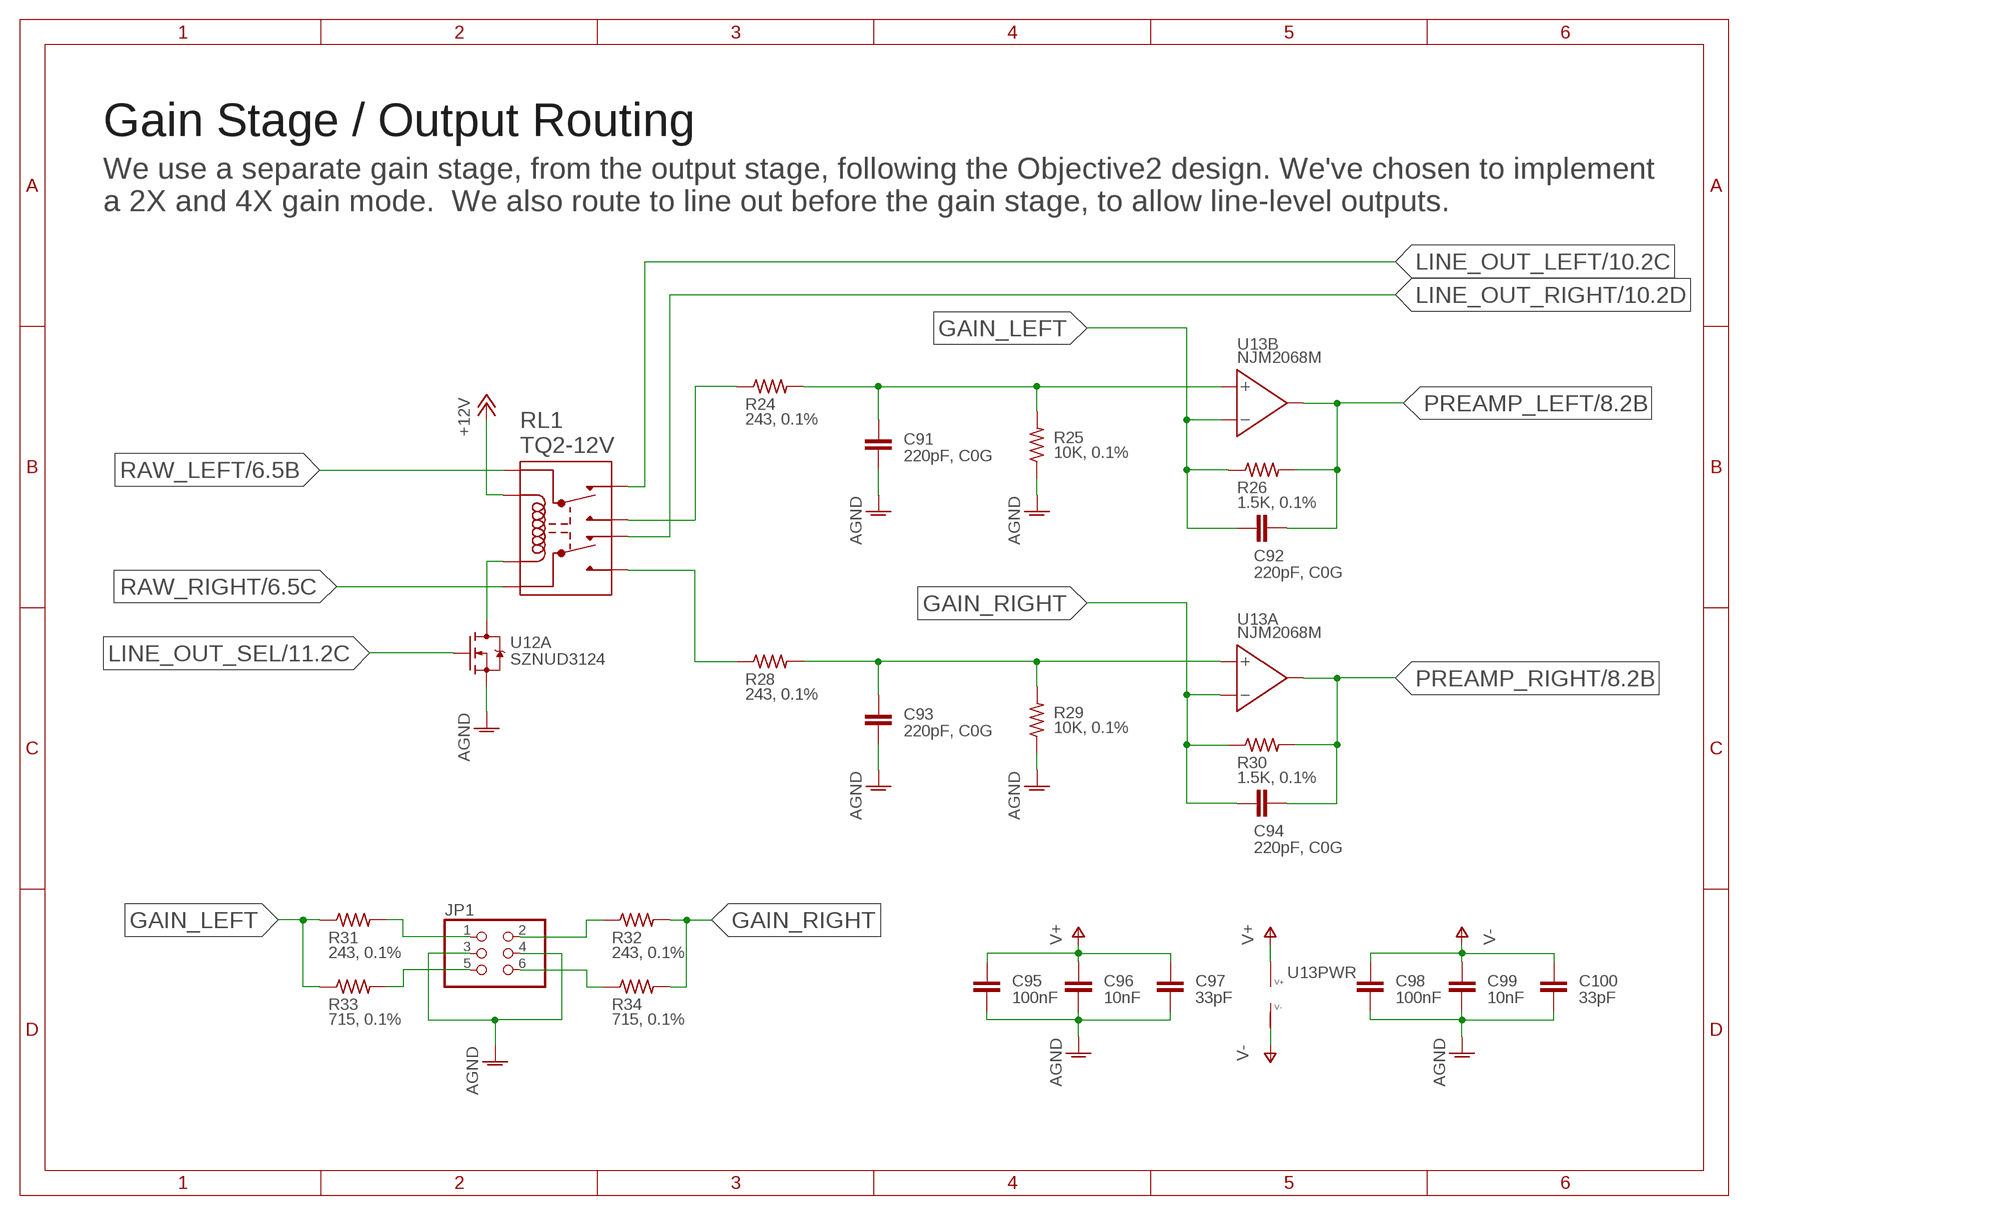
[diagram p6: schematic, sheet 7]
SHEET7 (A4L-NODOC): BOM: EXCLUDE

### Parts
C91  220pF, C0G  CAPACITOR-0402  [C0402]
C92  220pF, C0G  CAPACITOR-HORIZONTAL-0402  [C0402]
C93  220pF, C0G  CAPACITOR-0402  [C0402]
C94  220pF, C0G  CAPACITOR-HORIZONTAL-0402  [C0402]
C95  100nF  CAPACITOR-0402  [C0402]
C96  10nF  CAPACITOR-0402  [C0402]
C97  33pF  CAPACITOR-0402  [C0402]
C98  100nF  CAPACITOR-0402  [C0402]
C99  10nF  CAPACITOR-0402  [C0402]
C100  33pF  CAPACITOR-0402  [C0402]
JP1  PINHD-2X3  [2X03]
R24  243, 0.1%  RESISTOR-HORIZONTAL-0402  [R0402]
R25  10K, 0.1%  RESISTOR-0402  [R0402]
R26  1.5K, 0.1%  RESISTOR-HORIZONTAL-0402  [R0402]
R28  243, 0.1%  RESISTOR-HORIZONTAL-0402  [R0402]
R29  10K, 0.1%  RESISTOR-0402  [R0402]
R30  1.5K, 0.1%  RESISTOR-HORIZONTAL-0402  [R0402]
R31  243, 0.1%  RESISTOR-HORIZONTAL-0402  [R0402]
R32  243, 0.1%  RESISTOR-HORIZONTAL-0402  [R0402]
R33  715, 0.1%  RESISTOR-HORIZONTAL-0402  [R0402]
R34  715, 0.1%  RESISTOR-HORIZONTAL-0402  [R0402]
RL1  TQ2-12V  [TQ2]
U12  SZNUD3124  [SOT-457]
U13  NJM2068M  [DMP8]

### Nets
+12V: RL1.P$1(COIL_P) ; also sheet 1,2,3,10,12,13
AGND: C91.2 C93.2 C95.2 C96.2 C97.2 C98.2 C99.2 C100.2 JP1.3 JP1.4 R25.1 R29.1 U12.1(A:S) ; also sheet 1,2,3,4,5,6,8,9,10,11,12,13
GAIN_LEFT: C92.1 R26.1 R31.1 R33.1 U13.P$6(B:-IN)
GAIN_RIGHT: C94.1 R30.1 R32.2 R34.2 U13.P$2(A:-IN)
LINE_OUT_LEFT: RL1.P$2(NC1) ; also sheet 10
LINE_OUT_RIGHT: RL1.P$9(NC2) ; also sheet 10
LINE_OUT_SEL: U12.2(A:G) ; also sheet 5,11
N$15: RL1.P$10(COIL_N) U12.6(A:D)
N$17: C93.1 R28.2 R29.2 U13.P$3(A:+IN)
N$18: C91.1 R24.2 R25.2 U13.P$5(B:+IN)
N$23: R28.1 RL1.P$7(NO2)
N$26: R24.1 RL1.P$4(NO1)
N$28: JP1.1 R31.2
N$30: JP1.5 R33.2
N$31: JP1.6 R34.1
N$32: JP1.2 R32.1
PREAMP_LEFT: C92.2 R26.2 U13.P$7(B:OUT) ; also sheet 8
PREAMP_RIGHT: C94.2 R30.2 U13.P$1(A:OUT) ; also sheet 8
RAW_LEFT: RL1.P$3(COM1) ; also sheet 6
RAW_RIGHT: RL1.P$8(COM2) ; also sheet 6
V+: C95.1 C96.1 C97.1 U13.P$8(PWR:V+) ; also sheet 3,8,12
V-: C98.1 C99.1 C100.1 U13.P$4(PWR:V-) ; also sheet 3,8,12

### Notes on the sheet
- Gain Stage / Output Routing
- We use a separate gain stage, from the output stage, following the Objective2 design. We've chosen to implement
  a 2X and 4X gain mode.  We also route to line out before the gain stage, to allow line-level outputs.

## Sheet 8 of 13
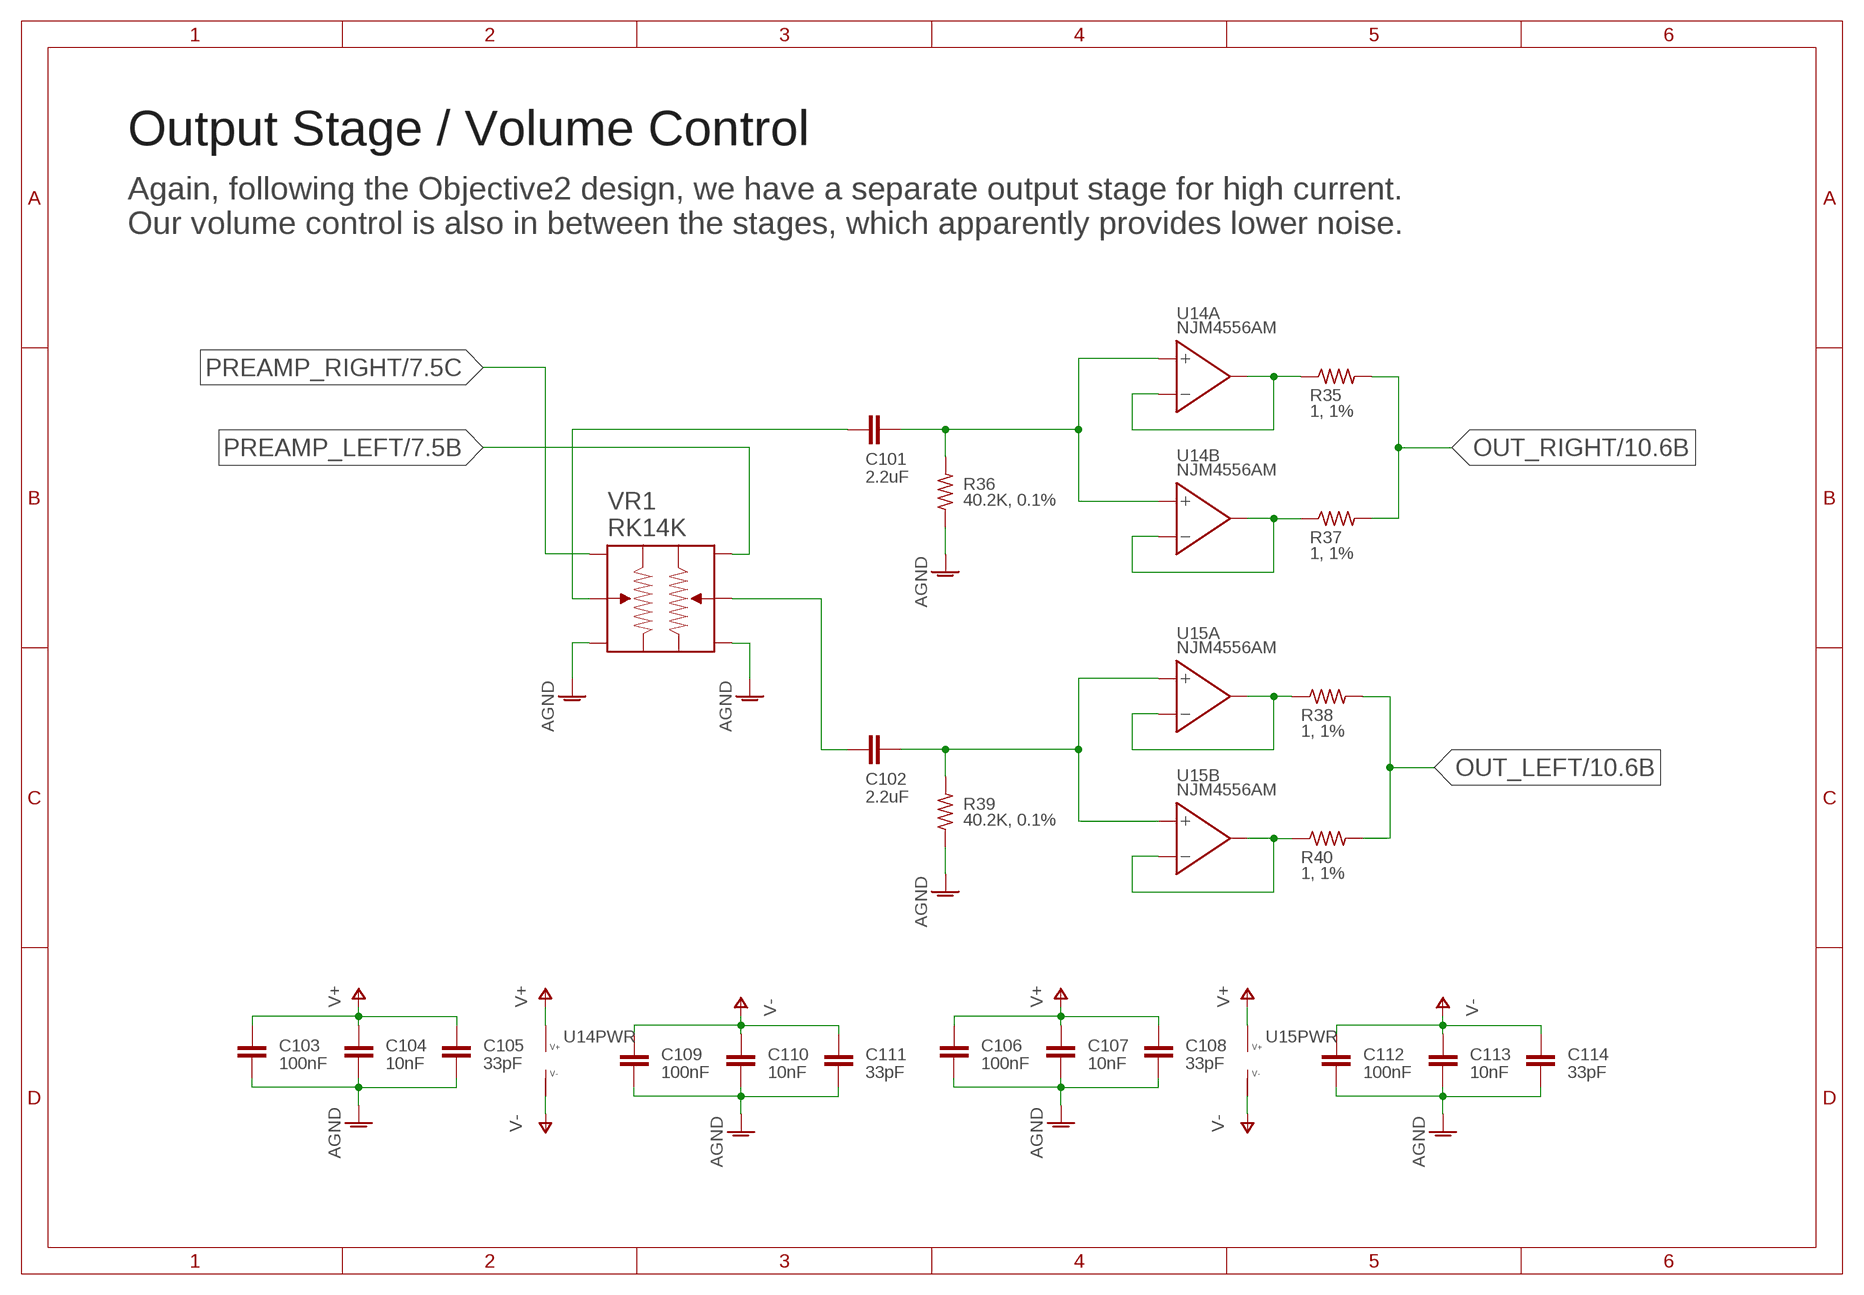
[diagram p7: schematic, sheet 8]
SHEET8 (A4L-NODOC): BOM: EXCLUDE

### Parts
C101  2.2uF  CAPACITOR-HORIZONTAL-KEMET-5MM-6.0-7.2  [KEMET-5MM-6.0-7.2]
C102  2.2uF  CAPACITOR-HORIZONTAL-KEMET-5MM-6.0-7.2  [KEMET-5MM-6.0-7.2]
C103  100nF  CAPACITOR-0402  [C0402]
C104  10nF  CAPACITOR-0402  [C0402]
C105  33pF  CAPACITOR-0402  [C0402]
C106  100nF  CAPACITOR-0402  [C0402]
C107  10nF  CAPACITOR-0402  [C0402]
C108  33pF  CAPACITOR-0402  [C0402]
C109  100nF  CAPACITOR-0402  [C0402]
C110  10nF  CAPACITOR-0402  [C0402]
C111  33pF  CAPACITOR-0402  [C0402]
C112  100nF  CAPACITOR-0402  [C0402]
C113  10nF  CAPACITOR-0402  [C0402]
C114  33pF  CAPACITOR-0402  [C0402]
R35  1, 1%  RESISTOR-HORIZONTAL-1206  [R1206]
R36  40.2K, 0.1%  RESISTOR-0402  [R0402]
R37  1, 1%  RESISTOR-HORIZONTAL-1206  [R1206]
R38  1, 1%  RESISTOR-HORIZONTAL-1206  [R1206]
R39  40.2K, 0.1%  RESISTOR-0402  [R0402]
R40  1, 1%  RESISTOR-HORIZONTAL-1206  [R1206]
U14  NJM4556AM  [DMP8]
U15  NJM4556AM  [DMP8]
VR1  RK14K  [RK14K]

### Nets
ADJUSTED_LEFT: C101.P$1 VR1.L2(WIPER_L)
ADJUSTED_RIGHT: C102.P$1 VR1.R2(WIPER_R)
AGND: C103.2 C104.2 C105.2 C106.2 C107.2 C108.2 C109.2 C110.2 C111.2 C112.2 C113.2 C114.2 R36.1 R39.1 VR1.L3(OUT_L) VR1.R3(OUT_R) ; also sheet 1,2,3,4,5,6,7,9,10,11,12,13
N$19: C101.P$2 R36.2 U14.P$3(A:+IN) U14.P$5(B:+IN)
N$20: C102.P$2 R39.2 U15.P$3(A:+IN) U15.P$5(B:+IN)
N$21: R35.1 U14.P$1(A:OUT) U14.P$2(A:-IN)
N$22: R37.1 U14.P$6(B:-IN) U14.P$7(B:OUT)
N$24: R38.1 U15.P$1(A:OUT) U15.P$2(A:-IN)
N$25: R40.1 U15.P$6(B:-IN) U15.P$7(B:OUT)
OUT_LEFT: R38.2 R40.2 ; also sheet 10
OUT_RIGHT: R35.2 R37.2 ; also sheet 10
PREAMP_LEFT: VR1.R1(IN_R) ; also sheet 7
PREAMP_RIGHT: VR1.L1(IN_L) ; also sheet 7
V+: C103.1 C104.1 C105.1 C106.1 C107.1 C108.1 U14.P$8(PWR:V+) U15.P$8(PWR:V+) ; also sheet 3,7,12
V-: C109.1 C110.1 C111.1 C112.1 C113.1 C114.1 U14.P$4(PWR:V-) U15.P$4(PWR:V-) ; also sheet 3,7,12

### Notes on the sheet
- Output Stage / Volume Control
- Again, following the Objective2 design, we have a separate output stage for high current.
  Our volume control is also in between the stages, which apparently provides lower noise.

## Sheet 9 of 13
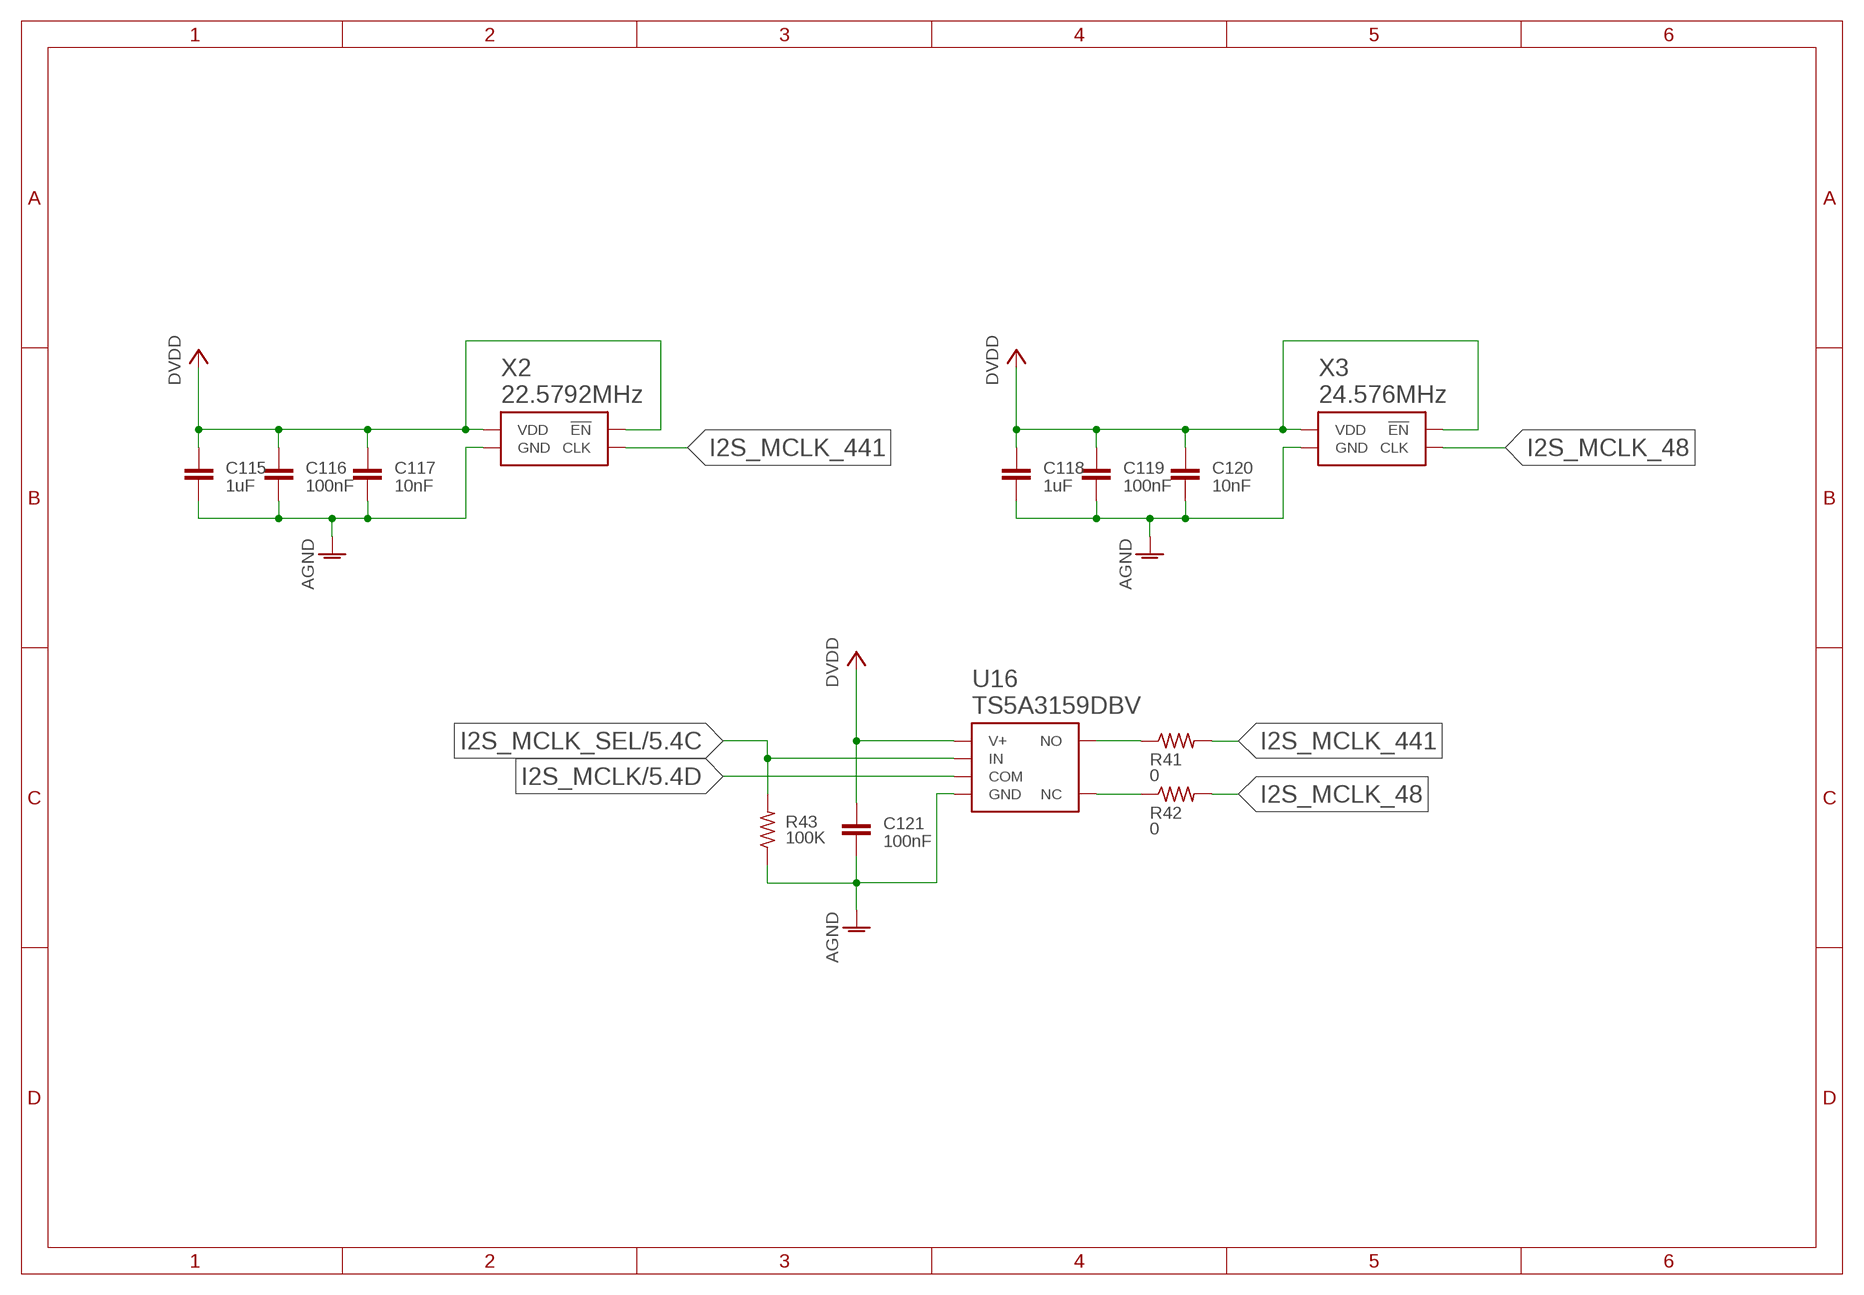
[diagram p8: schematic, sheet 9]
SHEET9 (A4L-NODOC): BOM: EXCLUDE

### Parts
C115  1uF  CAPACITOR-0603  [C0603]
C116  100nF  CAPACITOR-0402  [C0402]
C117  10nF  CAPACITOR-0402  [C0402]
C118  1uF  CAPACITOR-0603  [C0603]
C119  100nF  CAPACITOR-0402  [C0402]
C120  10nF  CAPACITOR-0402  [C0402]
C121  100nF  CAPACITOR-0402  [C0402]
R41  0  RESISTOR-HORIZONTAL-0402  [R0402]
R42  0  RESISTOR-HORIZONTAL-0402  [R0402]
R43  100K  RESISTOR-0402  [R0402]
U16  TS5A3159DBV  [R-PDSO-G6-DBV]
X2  22.5792MHz  KC2520K  [KC2520C]
X3  24.576MHz  KC2520K  [KC2520C]

### Nets
AGND: C115.2 C116.2 C117.2 C118.2 C119.2 C120.2 C121.2 R43.1 U16.2(GND) X2.P$2(GND) X3.P$2(GND) ; also sheet 1,2,3,4,5,6,7,8,10,11,12,13
DVDD: C115.1 C116.1 C117.1 C118.1 C119.1 C120.1 C121.1 U16.5(V+) X2.P$1(!EN) X2.P$4(VDD) X3.P$1(!EN) X3.P$4(VDD) ; also sheet 2,4,5,6,10,11,12
I2S_MCLK: U16.4(COM) ; also sheet 5,6
I2S_MCLK_48: R42.2 X3.P$3(CLK)
I2S_MCLK_441: R41.2 X2.P$3(CLK)
I2S_MCLK_SEL: R43.2 U16.6(IN) ; also sheet 5
N$51: R41.1 U16.1(NO)
N$59: R42.1 U16.3(NC)

## Sheet 10 of 13
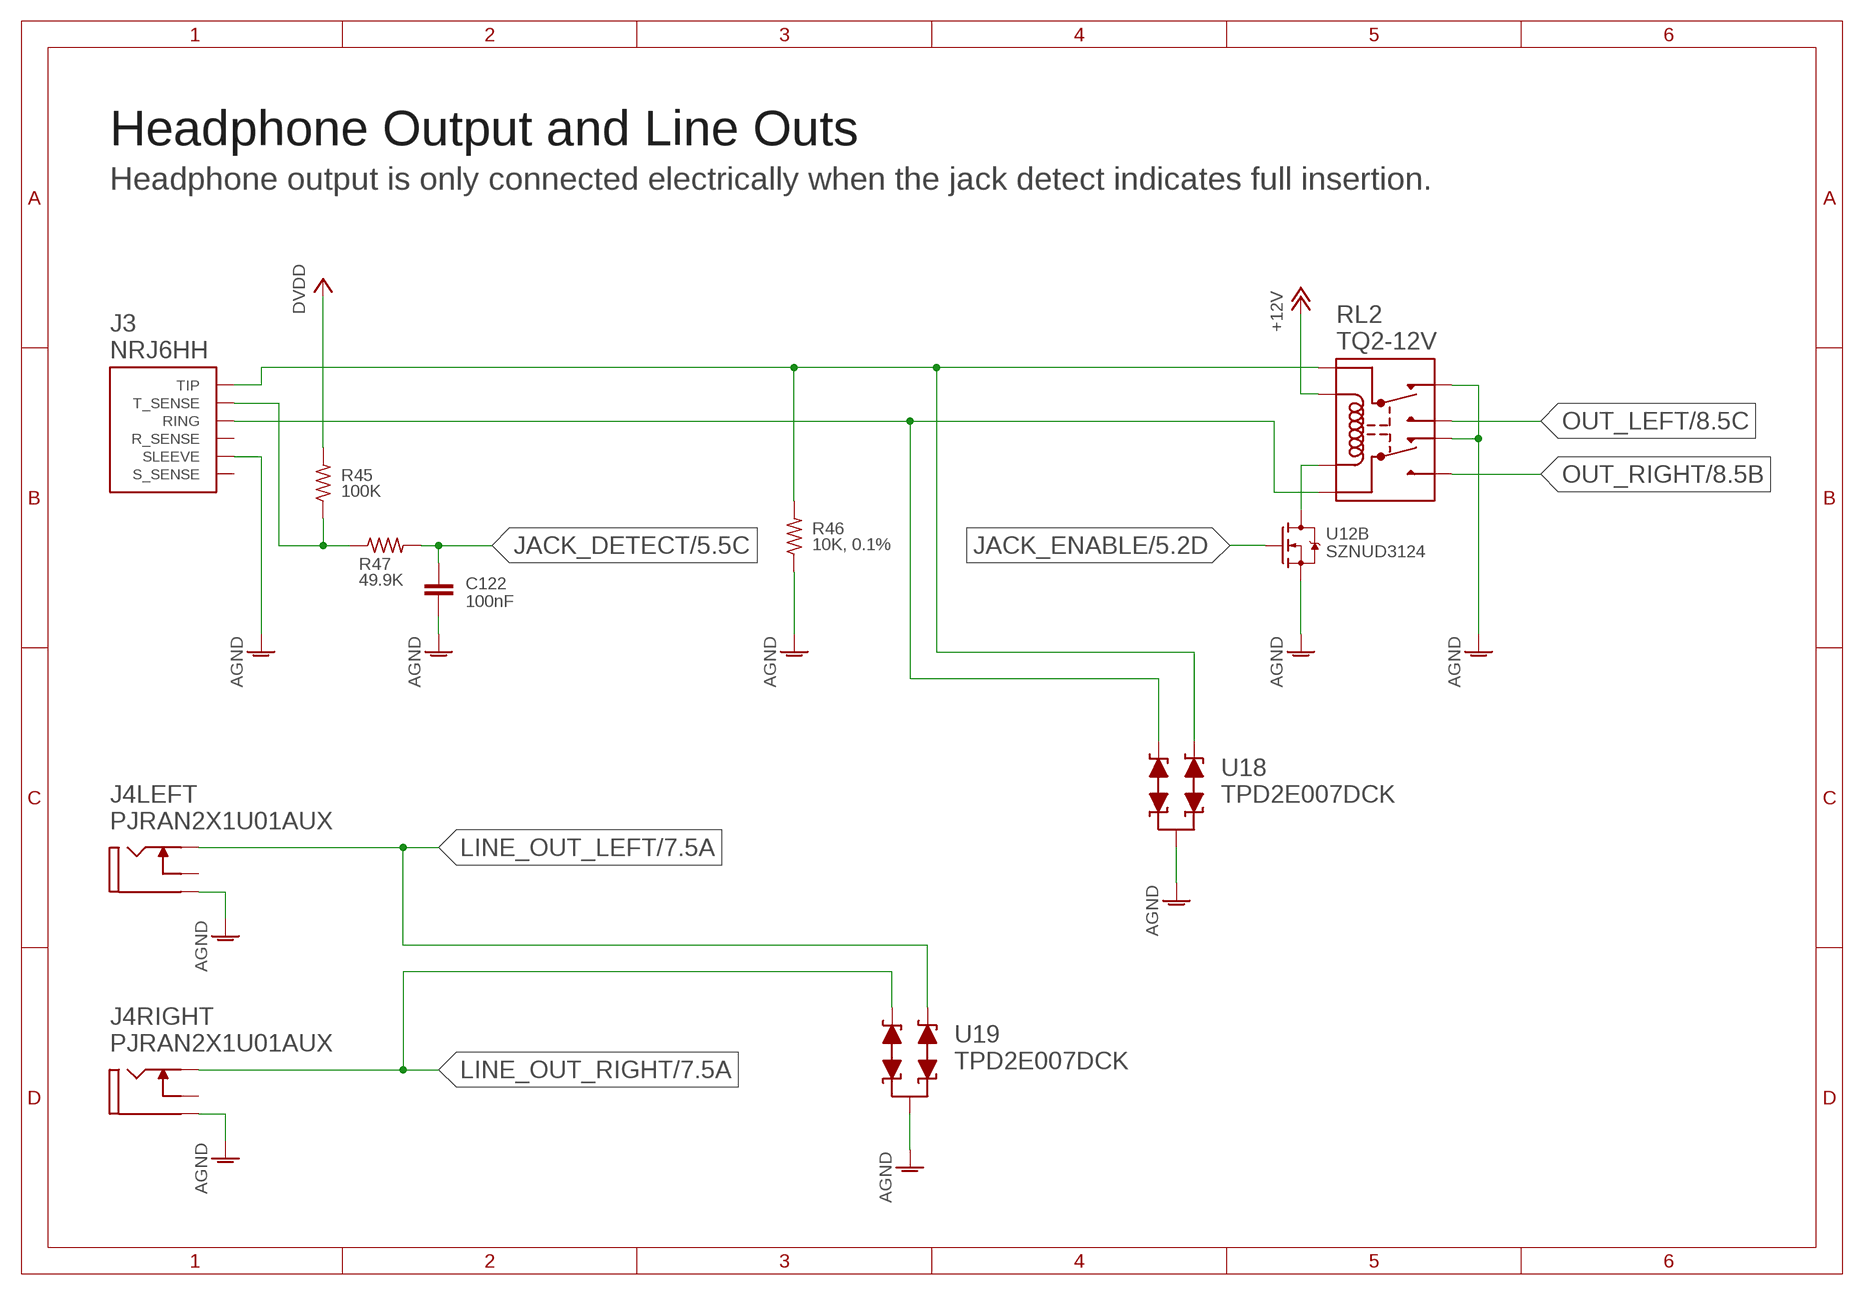
[diagram p9: schematic, sheet 10]
SHEET10 (A4L-NODOC): BOM: EXCLUDE

### Parts
C122  100nF  CAPACITOR-0402  [C0402]
J3  NRJ6HH  [NRJ6HH]
J4  PJRAN2X1U01AUX  PJRAN2XIU01AUX  [PJRAN2X1U]
R45  100K  RESISTOR-0402  [R0402]
R46  10K, 0.1%  RESISTOR-0402  [R0402]
R47  49.9K  RESISTOR-HORIZONTAL-0402  [R0402]
RL2  TQ2-12V  [TQ2]
U18  TPD2E007DCK  [R-PDSO-G3]
U19  TPD2E007DCK  [R-PDSO-G3]

### Nets
+12V: RL2.P$1(COIL_P) ; also sheet 1,2,3,7,12,13
AGND: C122.2 J3.S(SLEEVE) J4.L_SLEEVE(LEFT:SLEEVE) J4.R_SLEEVE(RIGHT:SLEEVE) R46.1 RL2.P$2(NC1) RL2.P$9(NC2) U12.4(B:S) U18.3(GND) U19.3(GND) ; also sheet 1,2,3,4,5,6,7,8,9,11,12,13
DVDD: R45.2 ; also sheet 2,4,5,6,9,11,12
JACK_DETECT: C122.1 R47.2 ; also sheet 5
JACK_ENABLE: U12.5(B:G) ; also sheet 5
LINE_OUT_LEFT: J4.L_TIP(LEFT:TIP) U19.2(IO2) ; also sheet 7
LINE_OUT_RIGHT: J4.R_TIP(RIGHT:TIP) U19.1(IO1) ; also sheet 7
N$27: J3.T(TIP) R46.2 RL2.P$3(COM1) U18.2(IO2)
N$29: J3.R(RING) RL2.P$8(COM2) U18.1(IO1)
N$64: RL2.P$10(COIL_N) U12.3(B:D)
N$79: J3.TN(T_SENSE) R45.1 R47.1
OUT_LEFT: RL2.P$4(NO1) ; also sheet 8
OUT_RIGHT: RL2.P$7(NO2) ; also sheet 8
Unconnected: J3.RN(R_SENSE) J3.SN(S_SENSE) J4.L_SHUNT(LEFT:SHUNT) J4.R_SHUNT(RIGHT:SHUNT)

### Notes on the sheet
- Headphone Output and Line Outs
- Headphone output is only connected electrically when the jack detect indicates full insertion.

## Sheet 11 of 13
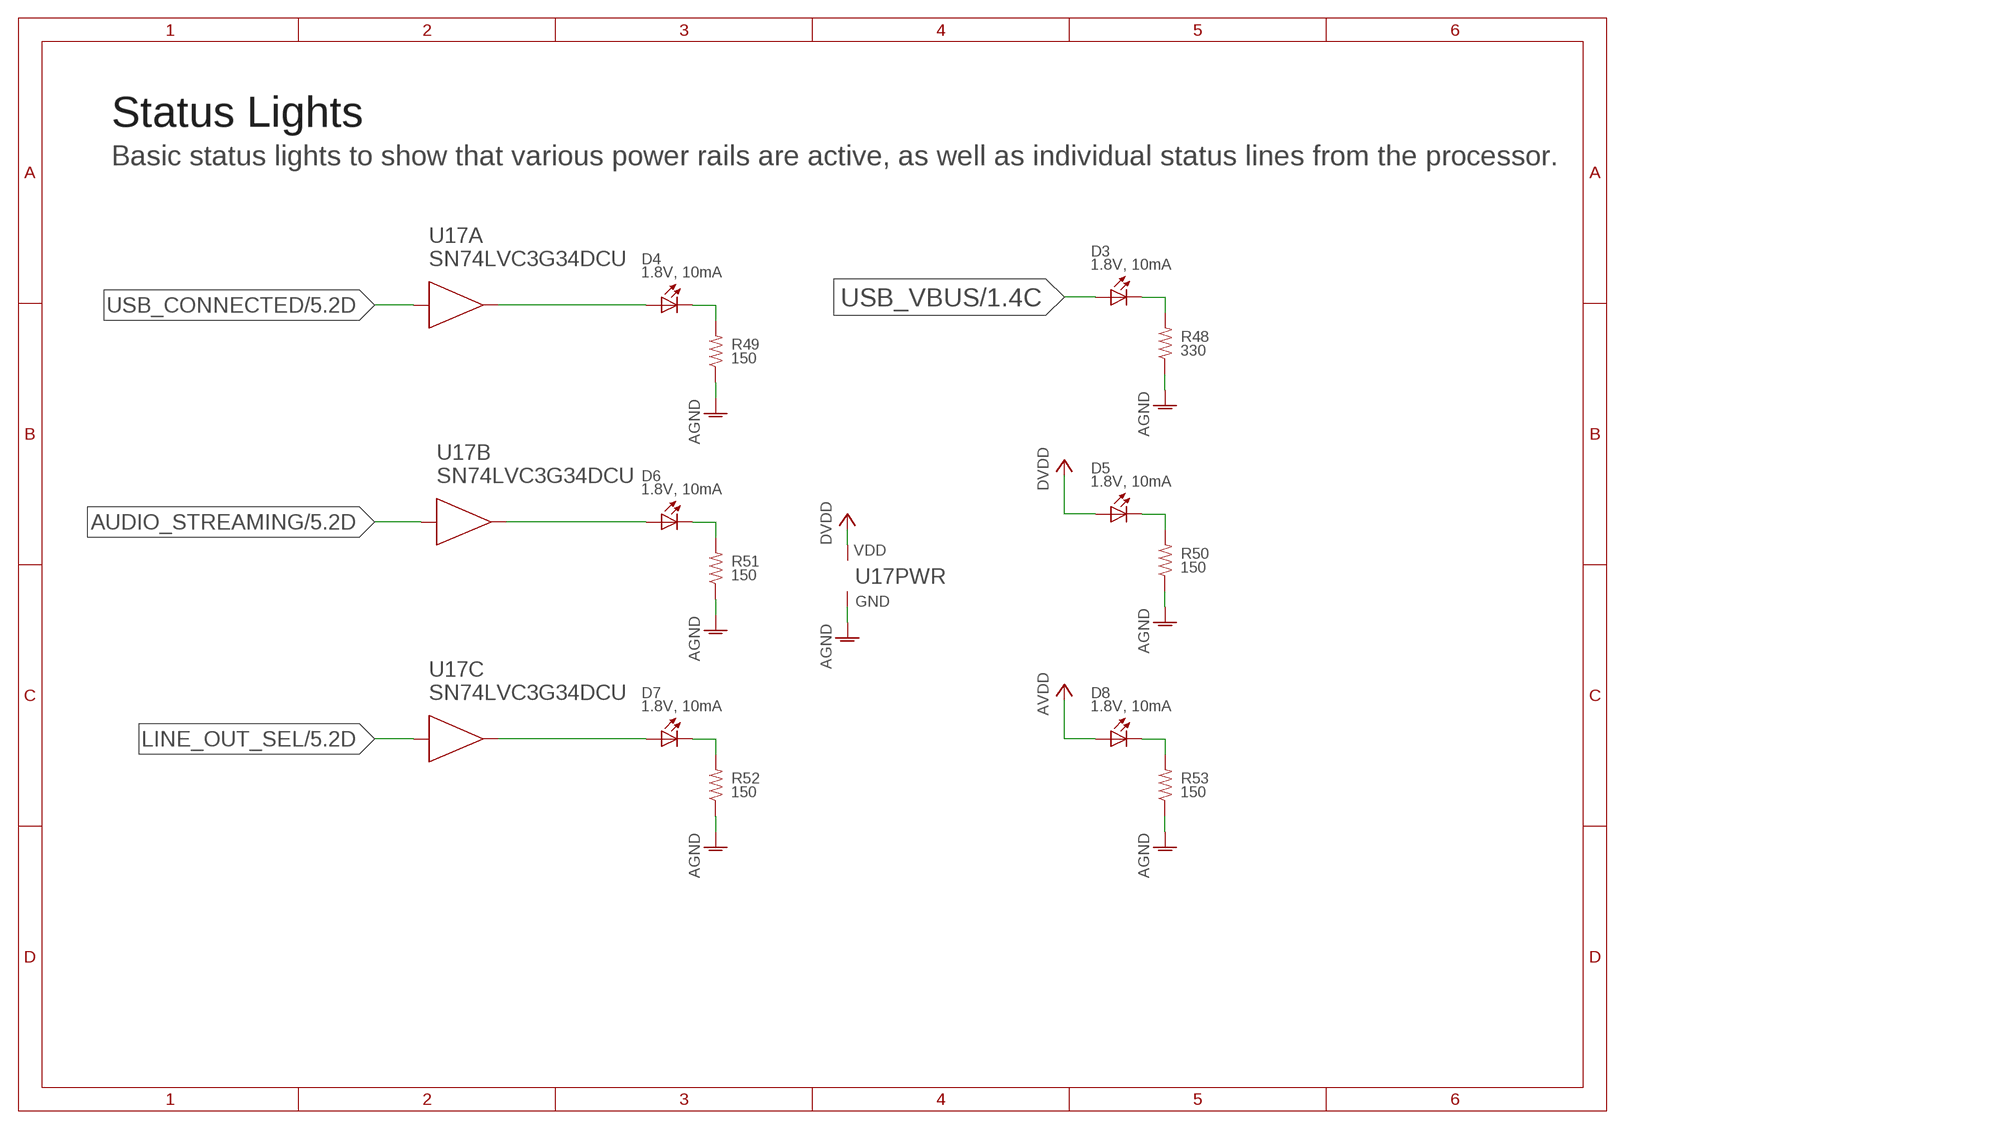
[diagram p10: schematic, sheet 11]
SHEET11 (A4L-NODOC): BOM: EXCLUDE

### Parts
D3  1.8V, 10mA  DIALIGHT-598-MICROSMD-0603  [DIALIGHT-0603]
D4  1.8V, 10mA  DIALIGHT-598-MICROSMD-0603  [DIALIGHT-0603]
D5  1.8V, 10mA  DIALIGHT-598-MICROSMD-0603  [DIALIGHT-0603]
D6  1.8V, 10mA  DIALIGHT-598-MICROSMD-0603  [DIALIGHT-0603]
D7  1.8V, 10mA  DIALIGHT-598-MICROSMD-0603  [DIALIGHT-0603]
D8  1.8V, 10mA  DIALIGHT-598-MICROSMD-0603  [DIALIGHT-0603]
R48  330  RESISTOR-0402  [R0402]
R49  150  RESISTOR-0402  [R0402]
R50  150  RESISTOR-0402  [R0402]
R51  150  RESISTOR-0402  [R0402]
R52  150  RESISTOR-0402  [R0402]
R53  150  RESISTOR-0402  [R0402]
U17  SN74LVC3G34DCU  [R-PDSO-G8-DCU]

### Nets
AGND: R48.1 R49.1 R50.1 R51.1 R52.1 R53.1 U17.4(PWR:GND) ; also sheet 1,2,3,4,5,6,7,8,9,10,12,13
AUDIO_STREAMING: U17.3(B:A) ; also sheet 5
AVDD: D8.1(A) ; also sheet 3,6,12
DVDD: D5.1(A) U17.8(PWR:VDD) ; also sheet 2,4,5,6,9,10,12
LINE_OUT_SEL: U17.6(C:A) ; also sheet 5,7
N$10: D8.2(C) R53.2
N$38: D3.2(C) R48.2
N$39: D5.2(C) R50.2
N$40: D4.1(A) U17.7(A:Y)
N$41: D4.2(C) R49.2
N$42: D6.1(A) U17.5(B:Y)
N$43: D6.2(C) R51.2
N$44: D7.1(A) U17.2(C:Y)
N$45: D7.2(C) R52.2
USB_CONNECTED: U17.1(A:A) ; also sheet 5
USB_VBUS: D3.1(A) ; also sheet 1

### Notes on the sheet
- Status Lights
- Basic status lights to show that various power rails are active, as well as individual status lines from the processor.

## Sheet 12 of 13
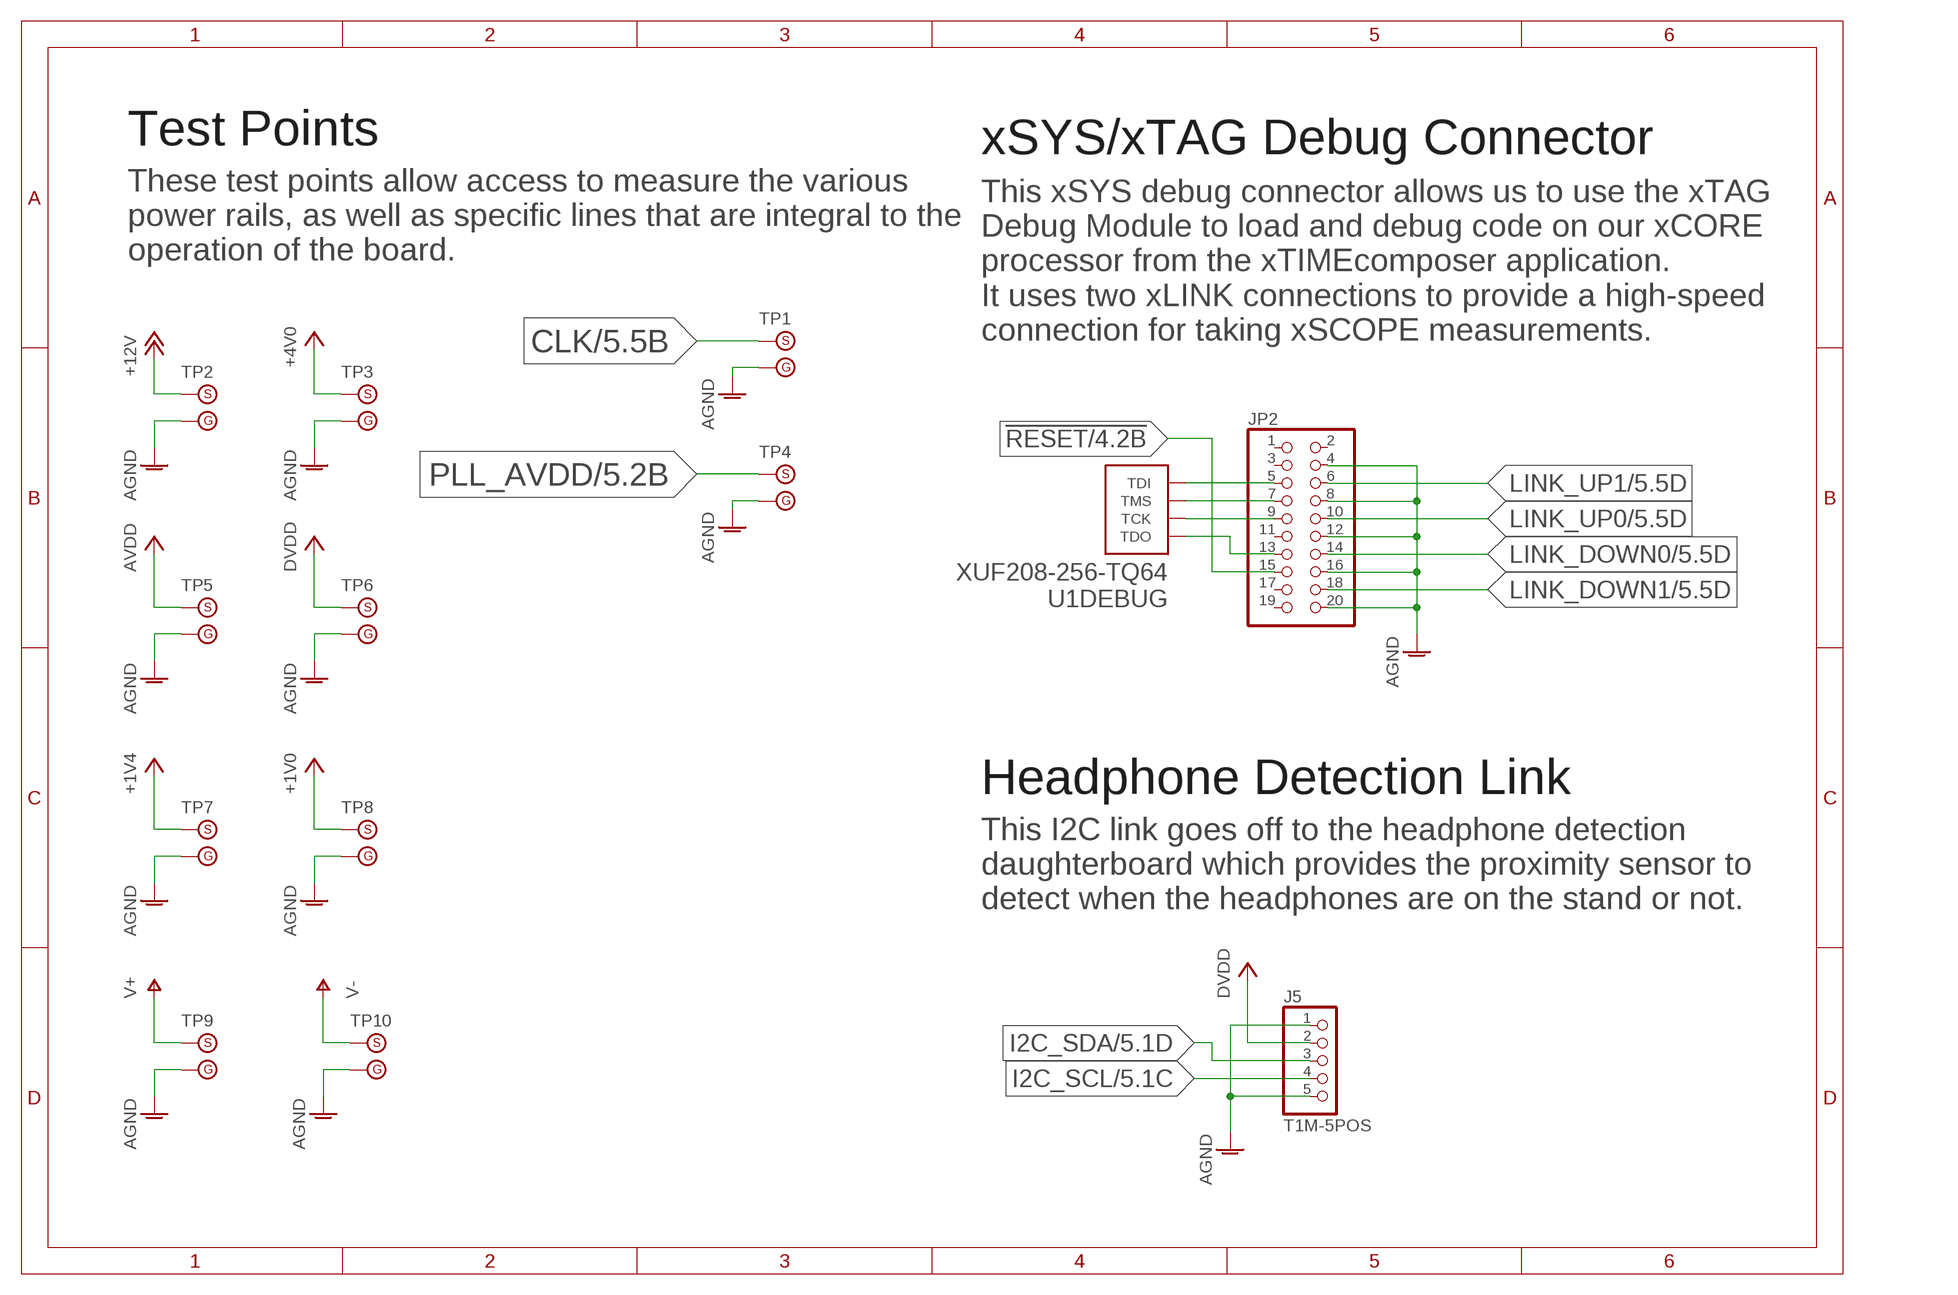
[diagram p11: schematic, sheet 12]
SHEET12 (A4L-NODOC): BOM: EXCLUDE

### Parts
J5  T1M-5POS  [T1M-SINGLE-5POS]
JP2  PINHD-2X10  [2X10]
TP1  TESTPOINT-WITH-GND  [TESTPOINT-1.5-WITH-GND]
TP2  TESTPOINT-WITH-GND  [TESTPOINT-1.5-WITH-GND]
TP3  TESTPOINT-WITH-GND  [TESTPOINT-1.5-WITH-GND]
TP4  TESTPOINT-WITH-GND  [TESTPOINT-1.5-WITH-GND]
TP5  TESTPOINT-WITH-GND  [TESTPOINT-1.5-WITH-GND]
TP6  TESTPOINT-WITH-GND  [TESTPOINT-1.5-WITH-GND]
TP7  TESTPOINT-WITH-GND  [TESTPOINT-1.5-WITH-GND]
TP8  TESTPOINT-WITH-GND  [TESTPOINT-1.5-WITH-GND]
TP9  TESTPOINT-WITH-GND  [TESTPOINT-1.5-WITH-GND]
TP10  TESTPOINT-WITH-GND  [TESTPOINT-1.5-WITH-GND]

### Nets
!RESET: JP2.15 ; also sheet 4,5
+1V0: TP8.S ; also sheet 2,4,5
+1V4: TP7.S ; also sheet 2
+4V0: TP3.S ; also sheet 2,3,4
+12V: TP2.S ; also sheet 1,2,3,7,10,13
AGND: J5.1 J5.5 JP2.4 JP2.8 JP2.12 JP2.16 JP2.20 TP1.G TP2.G TP3.G TP4.G TP5.G TP6.G TP7.G TP8.G TP9.G TP10.G ; also sheet 1,2,3,4,5,6,7,8,9,10,11,13
AVDD: TP5.S ; also sheet 3,6,11
CLK: TP1.S ; also sheet 5
DVDD: J5.2 TP6.S ; also sheet 2,4,5,6,9,10,11
I2C_SCL: J5.4 ; also sheet 5
I2C_SDA: J5.3 ; also sheet 5
LINK_DOWN0: JP2.14 ; also sheet 5
LINK_DOWN1: JP2.18 ; also sheet 5
LINK_UP0: JP2.10 ; also sheet 5
LINK_UP1: JP2.6 ; also sheet 5
N$46: JP2.7 U1.P$60(DEBUG:TMS)
N$47: JP2.9 U1.P$61(DEBUG:TCK)
N$48: JP2.5 U1.P$62(DEBUG:TDI)
N$49: JP2.13 U1.P$63(DEBUG:TDO)
PLL_AVDD: TP4.S ; also sheet 5
V+: TP9.S ; also sheet 3,7,8
V-: TP10.S ; also sheet 3,7,8
Unconnected: JP2.1 JP2.2 JP2.3 JP2.11 JP2.17 JP2.19

### Notes on the sheet
- Test Points | xSYS/xTAG Debug Connector
- These test points allow access to measure the various
  power rails, as well as specific lines that are integral to the
  operation of the board.
- This xSYS debug connector allows us to use the xTAG
  Debug Module to load and debug code on our xCORE
  processor from the xTIMEcomposer application.
  It uses two xLINK connections to provide a high-speed
  connection for taking xSCOPE measurements.
- Headphone Detection Link
- This I2C link goes off to the headphone detection
  daughterboard which provides the proximity sensor to
  detect when the headphones are on the stand or not.

## Sheet 13 of 13
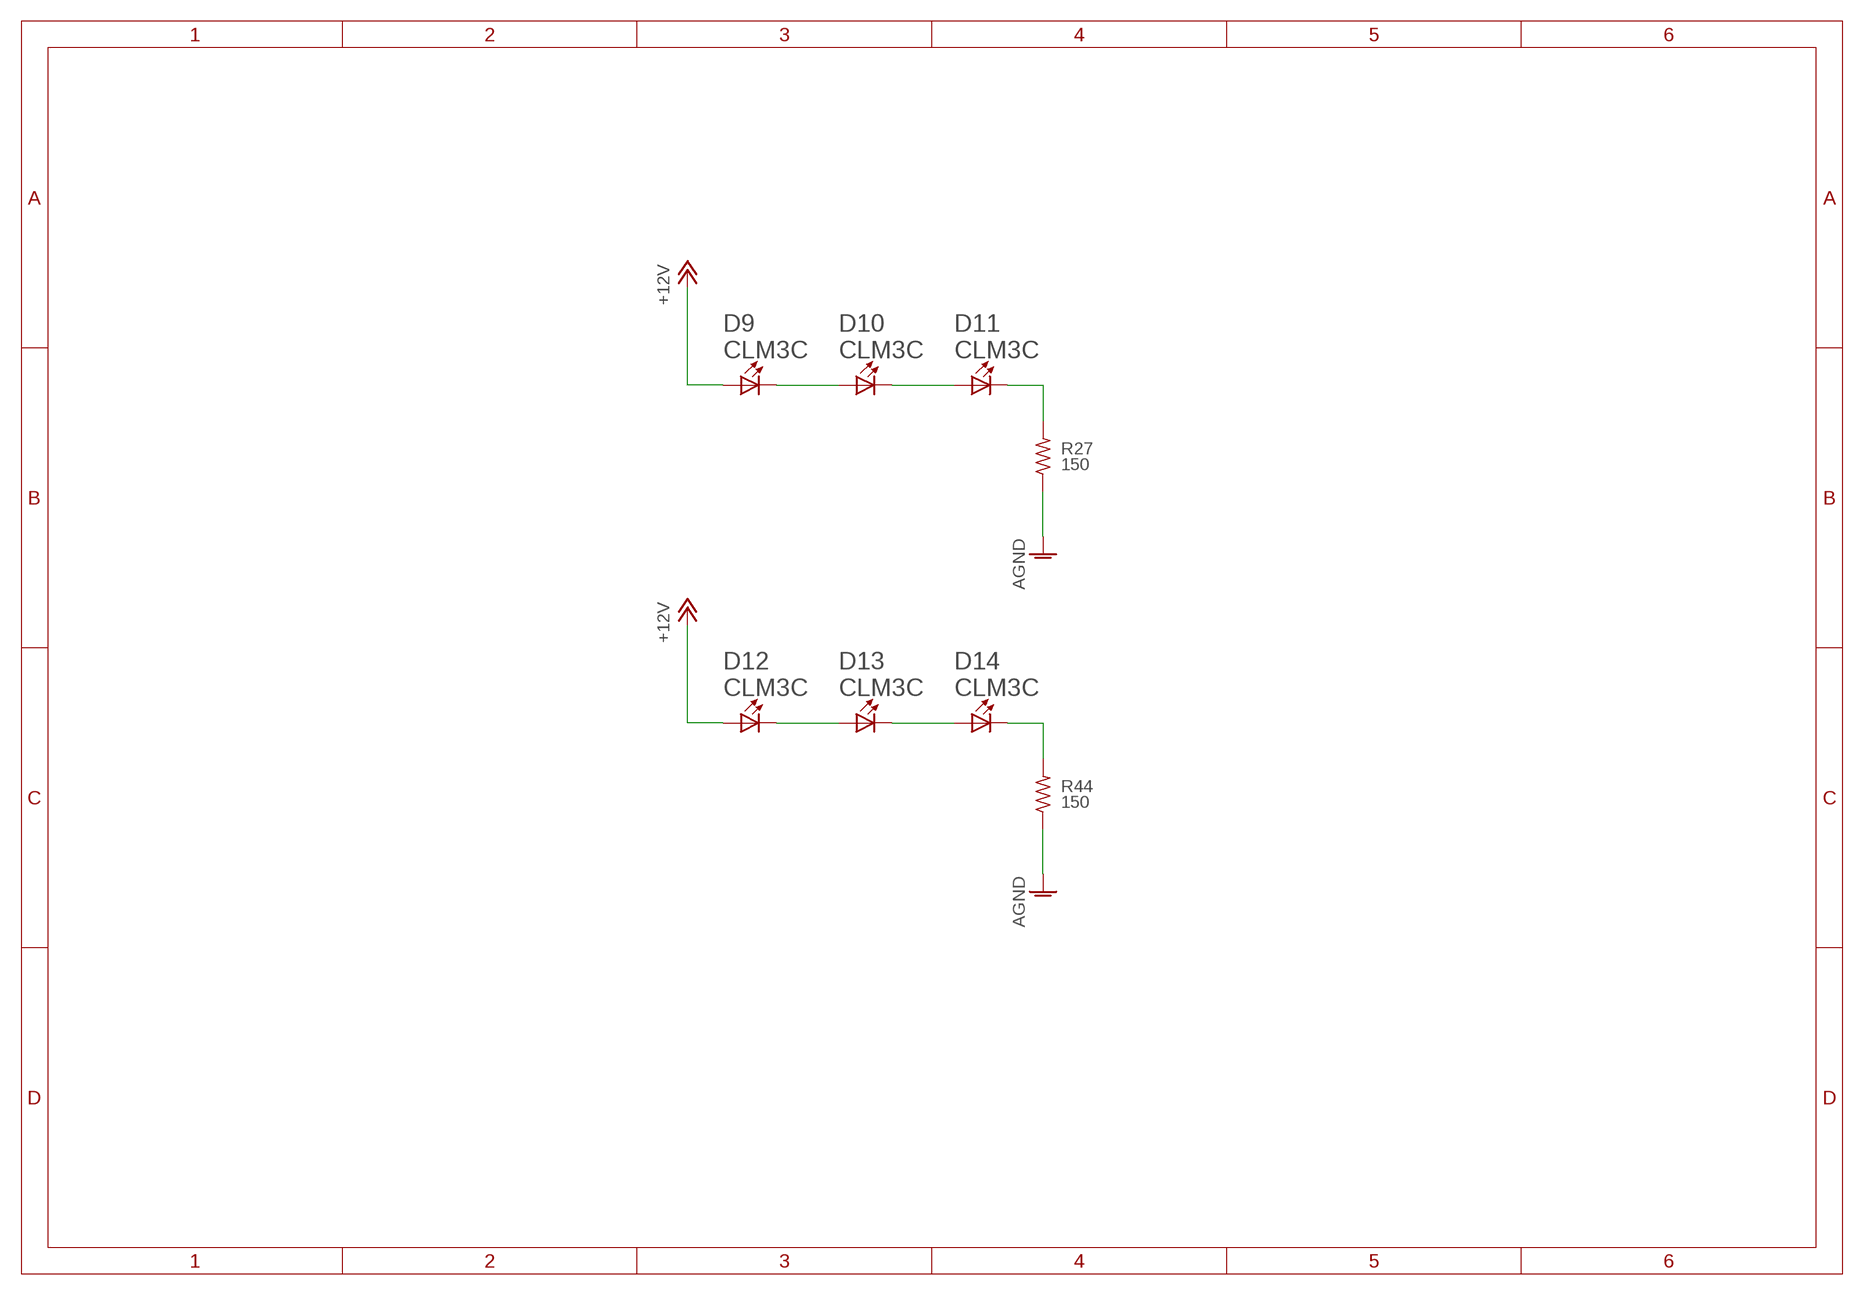
[diagram p12: schematic, sheet 13]
SHEET13 (A4L-NODOC): BOM: EXCLUDE

### Parts
D9  CLM3C  [PLCC-2]
D10  CLM3C  [PLCC-2]
D11  CLM3C  [PLCC-2]
D12  CLM3C  [PLCC-2]
D13  CLM3C  [PLCC-2]
D14  CLM3C  [PLCC-2]
R27  150  RESISTOR-1206  [R1206]
R44  150  RESISTOR-1206  [R1206]

### Nets
+12V: D9.ANODE(A) D12.ANODE(A) ; also sheet 1,2,3,7,10,12
AGND: R27.1 R44.1 ; also sheet 1,2,3,4,5,6,7,8,9,10,11,12
N$62: D9.CATHODE(C) D10.ANODE(A)
N$78: D10.CATHODE(C) D11.ANODE(A)
N$80: D11.CATHODE(C) R27.2
N$81: D12.CATHODE(C) D13.ANODE(A)
N$82: D13.CATHODE(C) D14.ANODE(A)
N$83: D14.CATHODE(C) R44.2

## Library data of the parts
C1-C6 = passives:CAPACITOR-POLARIZED: POLARIZED CAPACITOR, European symbol; PN: EMVA250ADA470MF55G
C7 C11 C15 C24 C28 C36 C44 C47 C52 C55 C115 C118 = passives:CAPACITOR: Capacitor; PN: GRM188R61E105KA12D
C8 C21 = passives:CAPACITOR-HORIZONTAL: Capacitor, horizontal; PN: C0805C104K5RACTU
C9 C20 C22 C33 C34 C41 C58 C59 C96 C99 C104 C107 C110 C113 C117 C120 = passives:CAPACITOR: Capacitor; PN: GRM15XR71C103KA86D
C10 C23 = passives:CAPACITOR: Capacitor; PN: 12063D226KAT2A
C12 C16 C25 C29 C37 C42 C45 C48-C50 C53 C56 C57 C60-C79 C85 C87 C89 C95 C98 C103 C106 C109 C112 C116 C119 C121 C122 = passives:CAPACITOR: Capacitor; PN: GRM155R71H104KE14D
C13 C26 = passives:CAPACITOR: Capacitor; PN: EMVA250ADA470MF55G
C14 C17-C19 C27 C30-C32 C35 C38-C40 C43 C46 C51 C54 C80 C86 C88 C90 = passives:CAPACITOR: Capacitor; PN: GRM21BR61E106KA73L
C81 C82 = passives:CAPACITOR: Capacitor; PN: GRM188R61C225KE15D
C83 C84 = passives:CAPACITOR: Capacitor; PN: C0402C222J3GACTU
C91 C93 = passives:CAPACITOR: Capacitor; PN: GRM1555C1H221JA01J
C92 C94 = passives:CAPACITOR-HORIZONTAL: Capacitor, horizontal; PN: GRM1555C1H221JA01J
C97 C100 C105 C108 C111 C114 = passives:CAPACITOR: Capacitor; PN: GRM1555C1H330JA01D
C101 C102 = passives:CAPACITOR-HORIZONTAL: Capacitor, horizontal; PN: RSBCC4220Z310K
D1 = nxp:PMEG3050BEP: 5A low Vf MEGA Schottky barrier rectiﬁer Planar Maximum Efﬁciency General Application (MEGA) Schottky barrier rectiﬁer with an integrated guard ring for stress protection, encapsulated in a SOD128 small and ﬂat lead Surface-Mounted Device (SMD) plastic package.; PN: PMEG3050BEP,115
D2 = diodes:SUPPRESSOR-DUAL-; PN: P4SMA16CA
D3-D8 = dialight:DIALIGHT-598-MICROSMD; PN: 598-8070-107F
D9-D14 = cree:CLM3C: Cree® PLCC2 1-in-1 SMD LED CLM3C; PN: CLM3C-WKW-CWBYA453
F1 = fuse:LITTLEFUSE: LITTLEFUSE Picofuse/slow Littlefuse; PN: 2920L030DR
J1 = cui:PJ-002A: DC Power Jack • 2.0 mm center pin • 2.5 A rating • right-angle orientation • through hole; PN: PJ-002A
J2 = te-connectivity:292304: USB Connectors 4P 'B' RECEPTACLE; PN: 292304-1
J3 = neutrik:NRJ6HH: 1/4" stereo jack, switched, half threaded nose; PN: NRJ6HH
J4 = switchcraft:PJRAN2XIU0: RCA Jack, Right Angle, 2 Position, PC Mount, Unshielded; PN: PJRAN2X1U01AUX
J5 = samtec:T1M-5POS: T1M Series - Discrete Wire Headers (1.00 mm / 0.03937"); PN: T1M-05-T-S-RA-TR
JP1 = pin-headers:PINHD-2X3: PIN HEADER; PN: 961206-6404-AR
JP2 = pin-headers:PINHD-2X10: PIN HEADER; PN: N2520-5002RB
L1 = passives:INDUCTOR-HORIZONTAL: INDUCTOR, American symbol; PN: VLP8040T-2R2N
L2 = passives:INDUCTOR-HORIZONTAL: INDUCTOR, American symbol; PN: VLP8040T-1R5N
R1 = passives:RESISTOR-HORIZONTAL; PN: RK73B1ETTP430J
R2 R4 R5 R7 R8 R13 = passives:RESISTOR; PN: RC0402FR-0710KL
R3 = passives:RESISTOR; PN: RK73H1ETTP4022F
R6 = passives:RESISTOR; PN: RC0402FR-078K45L
R9 = passives:RESISTOR; PN: RK73H1ETTP6652F
R10 = passives:RESISTOR; PN: RC0402FR-079K76L
R11 = passives:RESISTOR; PN: RK73H1ETTP1154F
R12 = passives:RESISTOR; PN: RC0402FR-07137KL
R14 = passives:RESISTOR; PN: SG73P1ETTP4R7J
R15 R21 R41 R42 = passives:RESISTOR-HORIZONTAL; PN: ERJ-2GE0R00X
R16 = passives:RESISTOR-HORIZONTAL; PN: RK73B1ETTP102J
R17 R18 = passives:RESISTOR; PN: RC0402FR-074K7L
R19 R20 = passives:RESISTOR-HORIZONTAL; PN: RK73B1ETTP330J
R22 R23 = passives:RESISTOR-HORIZONTAL; PN: RG1005P-471-B-T5
R24 R28 R31 R32 = passives:RESISTOR-HORIZONTAL; PN: ERA-2AEB2430X
R25 R29 R46 = passives:RESISTOR; PN: ERA-2AEB103X
R26 R30 = passives:RESISTOR-HORIZONTAL; PN: RG1005P-152-B-T5
R27 R44 = passives:RESISTOR; PN: RK73H2BTTD1500F
R33 R34 = passives:RESISTOR-HORIZONTAL; PN: ERA-2AEB7150X
R35 R37 R38 R40 = passives:RESISTOR-HORIZONTAL; PN: MCA12060C1008FP500
R36 R39 = passives:RESISTOR; PN: RG1005P-4022-B-T5
R43 R45 = passives:RESISTOR; PN: RK73H1ETTP1003F
R47 = passives:RESISTOR-HORIZONTAL; PN: RC0402FR-0749K9L
R48 = passives:RESISTOR; PN: ERJ-PA2J331X
R49-R53 = passives:RESISTOR; PN: SG73P1ETTP151J
RL1 RL2 = panasonic:TQ2: 5 mm Low profile, 2 Form C and 2 A (surface mount type) relays; PN: TQ2-12V
TP1-TP10 = test:TESTPOINT-WITH-GND; BOM: EXCLUDE
U1 = xmos:XUF208-256-TQ64: Multicore Microcontroller with Advanced Multi-Core RISC Architecture https://www.xmos.com/download/private/XUF208-256-TQ64-Datasheet%281.10%29.pdf; PN: XUF208-256-TQ64-C10
U2 = texas-instruments:TPD4E02B04: 4-Channel ESD Protection Diode for USB Type-C and HDMI 2.0; PN: TPD4E02B04DQAR
U3 U5 = texas-instruments:TPS563200; PN: TPS563200DDCR
U4 U6 U7 = texas-instruments:TPS7A8300: 2-A, 6-µVRMS, RF, LDO Voltage Regulator; PN: TPS7A8300RGWR
U8 = texas-instruments:TPS7A4701: 36V, 1A, 4µVrms noise, RF LDO Voltage Regulator; PN: TPS7A4701RGWR
U9 = texas-instruments:TPS7A33: –36V, 1A, Ultralow-Noise Negative Voltage Regulator; PN: TPS7A3301RGWR
U10 = texas-instruments:TPS3702: High-Accuracy, Overvoltage and Undervoltage Monitor; PN: TPS3702CX10DDCT
U11 = texas-instruments:PCM5102A: 2VRMS DirectPath™, 112dB Audio Stereo DAC with 32-bit, 384kHz PCM Interface The PCM510xA devices are a family of monolithic CMOS integrated circuits that include a stereo digital-to-analog converter and additional support circuitry in a small TSSOP package. The PCM510xA uses the latest generation of TI’s advanced segment-DAC architecture to achieve excellent dynamic performance and improved tolerance to clock jitter. The PCM510xA provides 2.1VRMS ground centered outputs, allowing designers to eliminate DC blocking capacitors on the output, as well as external muting circuits traditionally associated with single supply line drivers. The integrated line driver surpasses all other charge-pump based line drivers by supporting loads down to 1kΩ. By supporting loads down to 1kΩ, the PCM510xA can essentially drive up to 10 products in parallel. (LCD TV, DVDR, AV Receivers etc). The integrated PLL on the device removes the requirement for a system clock (commonly known as master clock), allowing a 3-wire I2S connection and reducing system EMI. Intelligent clock error and PowerSense under voltage protection utilizes a two level mute system for pop-free performance. Upon clock error or system power failure, the device digitally attenuates the data (or last known good data), then mutes the analog circuit. Compared with existing DAC technology, the PCM510xA family offers up to 20dB lower out-of-band noise, reducing EMI and aliasing in downstream amplifiers/ADCs. (from traditional 100kHz OBN measurements all the way to 3MHz) The PCM510xA accepts industry-standard audio data formats with 16- to 32-bit data. Sample rates up to 384kHz are supported.; PN: PCM5102APWR
U12 = on-semiconductor:SZNUD3124: Automotive Inductive Load Driver (two channel) This micro−integrated part provides a single component solution to switch inductive loads such as relays, solenoids, and small DC motors without the need of a free−wheeling diode. It accepts logic level inputs, thus allowing it to be driven by a large variety of devices including logic gates, inverters, and microcontrollers.; PN: SZNUD3124DMT1G
U13 = njr:NJM2068: LOW-NOISE DUAL OPERATIONAL AMPLIFIER The NJM2068 is a high performance, low noise dual operational amplifier. This amplifier features popular pin-out, superior noise performance, and superior total harmonic distortion. This amplifier also features guaranteed noise performance with substantially higher gain-bandwidth product and slew rate, which far exceeds that of the 4558 type amplifier. The specially designed low noise input transistors allow the NJM2068 to be used in very low noise signal processing applications such as audio preamplifiers and servo error amplifier.; PN: NJM2068M-TE1
U14 U15 = njr:NJM4556A: DUAL HIGH CURRENT OPERATIONAL AMPLIFIER The NJM4556A integrated circuit is a high-gain,high output current dual operational amplifier capable of driving ±70mA into 150Ω loads ( ±10.5V output voltage ),and operating low supply voltage ( V+/V-=±2V~ ). The NJM4556A combines many of the features of the popular NJM4558 as well as having the capability of driving 150Ω loads.In addition,the wide band-width,low noise,high slew rate and low distortion of the NJM4556A make it ideal for many audio,telecommunications and instrumentation applications.; PN: NJM4556AM-TE1
U16 = texas-instruments:TS5A3159: 1-Ω SPDT Analog Switch; PN: TS5A3159DBVR
U17 = texas-instruments:SN74LVC3G34: Triple Buffer Gate; PN: SN74LVC3G34DCUT
U18 U19 = texas-instruments:TPD2E007: 2-Channel ESD Protection Array for AC-Coupled/Negative-Rail Data Interfaces; PN: TPD2E007DCKR
U$1-U$13 = fiducials:FIDUCIAL: Fidicual Mark Used by pick-and-place machines to align and orient boards before loading components.; BOM: EXCLUDE
VR1 = alps:RK14K: 14mm Size Insulated Shaft Snap-in Type RK14K Series; PN: RK14K1240A4S
X1 = crystals:KC2520C: High Stability Clock Oscillators, CMOS, 2.5V/3.3V Compatible, 2.5×2.0mm; PN: KC2520C24.0000C2LE00
X2 = crystals:KC2520K: Clock Oscillators, CMOS, 1.8V/2.5V/3.3V Compatible, 2.5×2.0mm; PN: KC2520K22.5792C1GE00
X3 = crystals:KC2520K: Clock Oscillators, CMOS, 1.8V/2.5V/3.3V Compatible, 2.5×2.0mm; PN: KC2520K24.5760C1GE00

## Net classes
0 default: width 0.152 mm, drill 0.254 mm
1 USB: width 0.279 mm, drill 0.254 mm